# EAGLE design v3 (EAGLE 6.3)

## Sheet 1 of 3
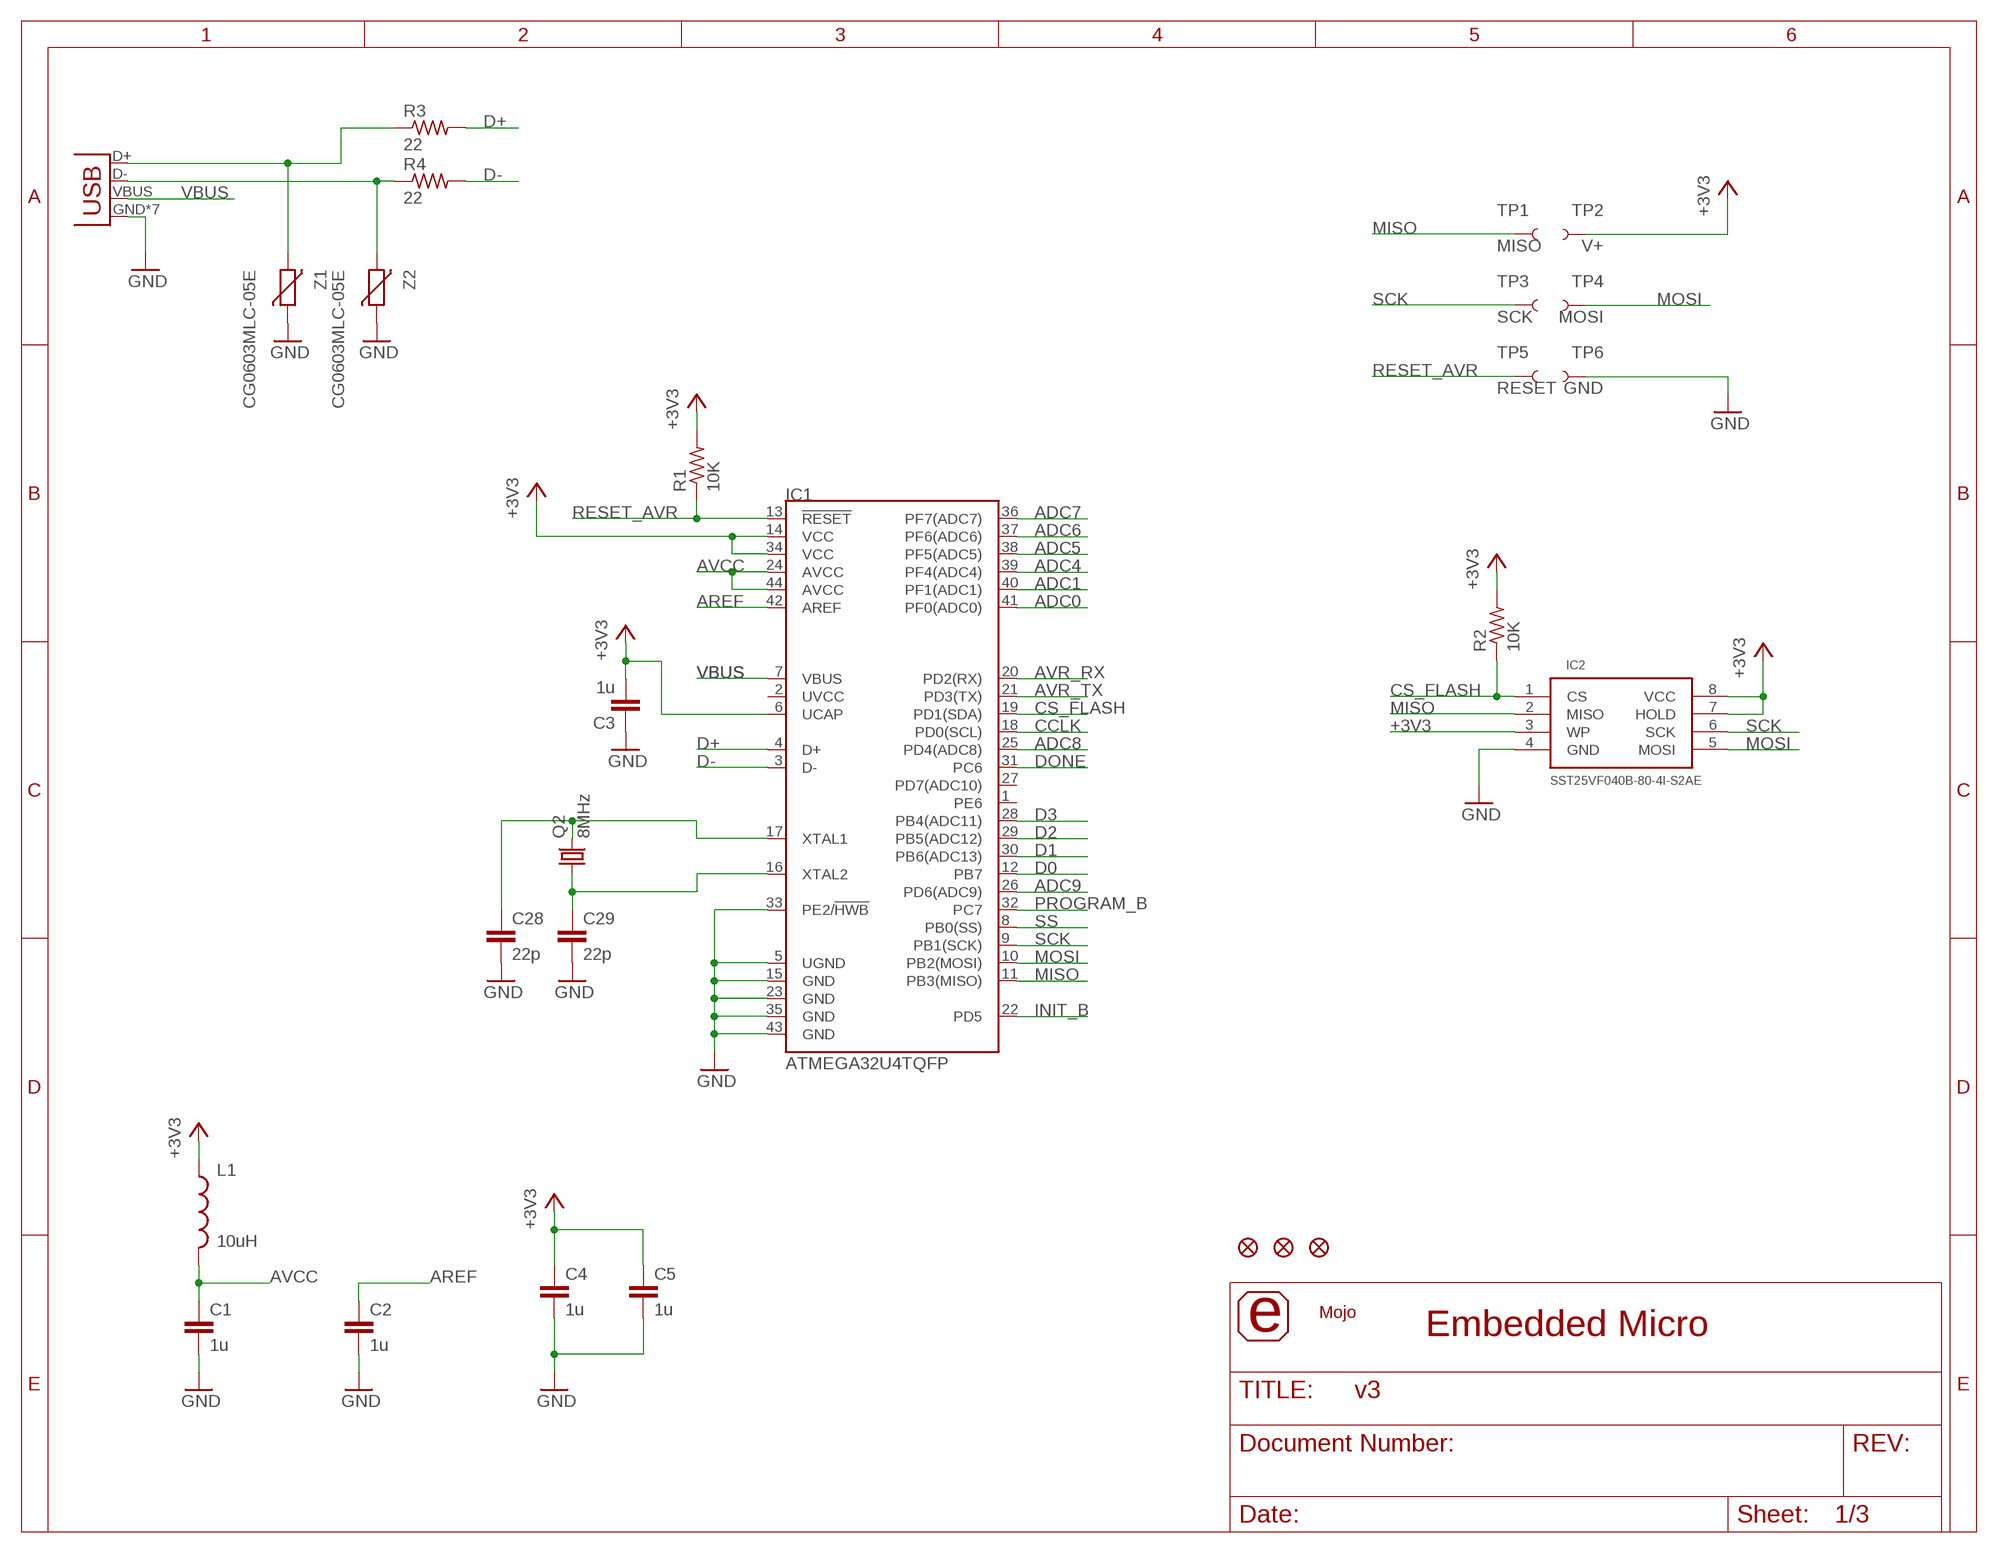
[diagram p0: schematic, sheet 1]

### Parts
C1  1u  C-EUC0603K  [C0603K]
C2  1u  C-EUC0603K  [C0603K]
C3  1u  C-EUC0603K  [C0603K]
C4  1u  C-EUC0603K  [C0603K]
C5  1u  C-EUC0603K  [C0603K]
C28  22p  C-EUC0603K  [C0603K]
C29  22p  C-EUC0603K  [C0603K]
IC1  ATMEGA32U4TQFP  [SPARKFUN-DIGITALIC_TQFP44]
IC2  SST25VF040B-80-4I-S2AE  SPI_FLASH-X25XXSMD1  [SO08-EIAJ]
JP3  FIDUCIAL1X2  [FIDUCIAL-1X2]
JP4  FIDUCIAL1X2  [FIDUCIAL-1X2]
JP5  FIDUCIAL1X2  [FIDUCIAL-1X2]
L1  10uH  INDUCTOR0603  [0603]
Q2  8MHz  CRYSTALABM2  [ABM2]
R1  10K  R-US_R0603  [R0603]
R2  10K  R-US_R0603  [R0603]
R3  22  R-US_R0603  [R0603]
R4  22  R-US_R0603  [R0603]
TP1  MISO  TEST-POINT3X5  [PAD.03X.05]
TP2  V+  TEST-POINT3X5  [PAD.03X.05]
TP3  SCK  TEST-POINT3X5  [PAD.03X.05]
TP4  MOSI  TEST-POINT3X5  [PAD.03X.05]
TP5  RESET  TEST-POINT3X5  [PAD.03X.05]
TP6  GND  TEST-POINT3X5  [PAD.03X.05]
U$1  LOGO(SMALL)SMALL  [LOGO]
U$2  MOJO_LOGOV3  [MOJO_LOGO_V3]
X1  USB-MICROB  [USB-MICROB]
Z1  CG0603MLC-05E  VARISTORCN0603  [CT/CN0603]
Z2  CG0603MLC-05E  VARISTORCN0603  [CT/CN0603]

### Nets
+3V3: C3.2 C4.1 C5.1 IC1.6(UCAP) IC1.14(VCC) IC1.34(VCC) IC2.3(WP) IC2.7(HOLD) IC2.8(VCC) L1.1 R1.2 R2.2 TP2.P$1 ; also sheet 2,3
ADC0: IC1.41(PF0(ADC0)) ; also sheet 3
ADC1: IC1.40(PF1(ADC1)) ; also sheet 3
ADC4: IC1.39(PF4(ADC4)) ; also sheet 3
ADC5: IC1.38(PF5(ADC5)) ; also sheet 3
ADC6: IC1.37(PF6(ADC6)) ; also sheet 3
ADC7: IC1.36(PF7(ADC7)) ; also sheet 3
ADC8: IC1.25(PD4(ADC8)) ; also sheet 3
ADC9: IC1.26(PD6(ADC9)) ; also sheet 3
AREF: C2.1 IC1.42(AREF) ; also sheet 3
AVCC: C1.1 IC1.24(AVCC) IC1.44(AVCC) L1.2
AVR_RX: IC1.20(PD2(RX)) ; also sheet 2
AVR_TX: IC1.21(PD3(TX)) ; also sheet 2
CCLK: IC1.18(PD0(SCL)) ; also sheet 2
CS_FLASH: IC1.19(PD1(SDA)) IC2.1(CS) R2.1
D0: IC1.12(PB7) ; also sheet 2
D1: IC1.30(PB6(ADC13)) ; also sheet 2
D2: IC1.29(PB5(ADC12)) ; also sheet 2
D3: IC1.28(PB4(ADC11)) ; also sheet 2
D+: IC1.4(D+) R3.2
D-: IC1.3(D-) R4.2
DONE: IC1.31(PC6) ; also sheet 2,3
GND: C1.2 C2.2 C3.1 C4.2 C5.2 C28.2 C29.2 IC1.5(UGND) IC1.15(GND) IC1.23(GND) IC1.33(PE2/!HWB) IC1.35(GND) IC1.43(GND) IC2.4(GND) TP6.P$1 X1.GND X1.P1(GND) X1.P2(GND) X1.P3(GND) X1.P4(GND) X1.P5(GND) X1.P6(GND) Z1.1 Z2.1 ; also sheet 2,3
INIT_B: IC1.22(PD5) ; also sheet 2
MISO: IC1.11(PB3(MISO)) IC2.2(MISO) TP1.P$1 ; also sheet 2
MOSI: IC1.10(PB2(MOSI)) IC2.5(MOSI) TP4.P$1 ; also sheet 2
N$11: R3.1 X1.D+ Z1.2
N$12: R4.1 X1.D- Z2.2
N$13: C28.1 IC1.17(XTAL1) Q2.P$2
N$14: C29.1 IC1.16(XTAL2) Q2.P$1
PROGRAM_B: IC1.32(PC7) ; also sheet 2
RESET_AVR: IC1.13(!RESET) R1.1 TP5.P$1
SCK: IC1.9(PB1(SCK)) IC2.6(SCK) TP3.P$1 ; also sheet 2
SS: IC1.8(PB0(SS)) ; also sheet 2
VBUS: IC1.7(VBUS) X1.VBUS ; also sheet 3
Unconnected: IC1.1(PE6) IC1.2(UVCC) IC1.27(PD7(ADC10))

### Notes on the sheet
- Embedded Micro

## Sheet 2 of 3
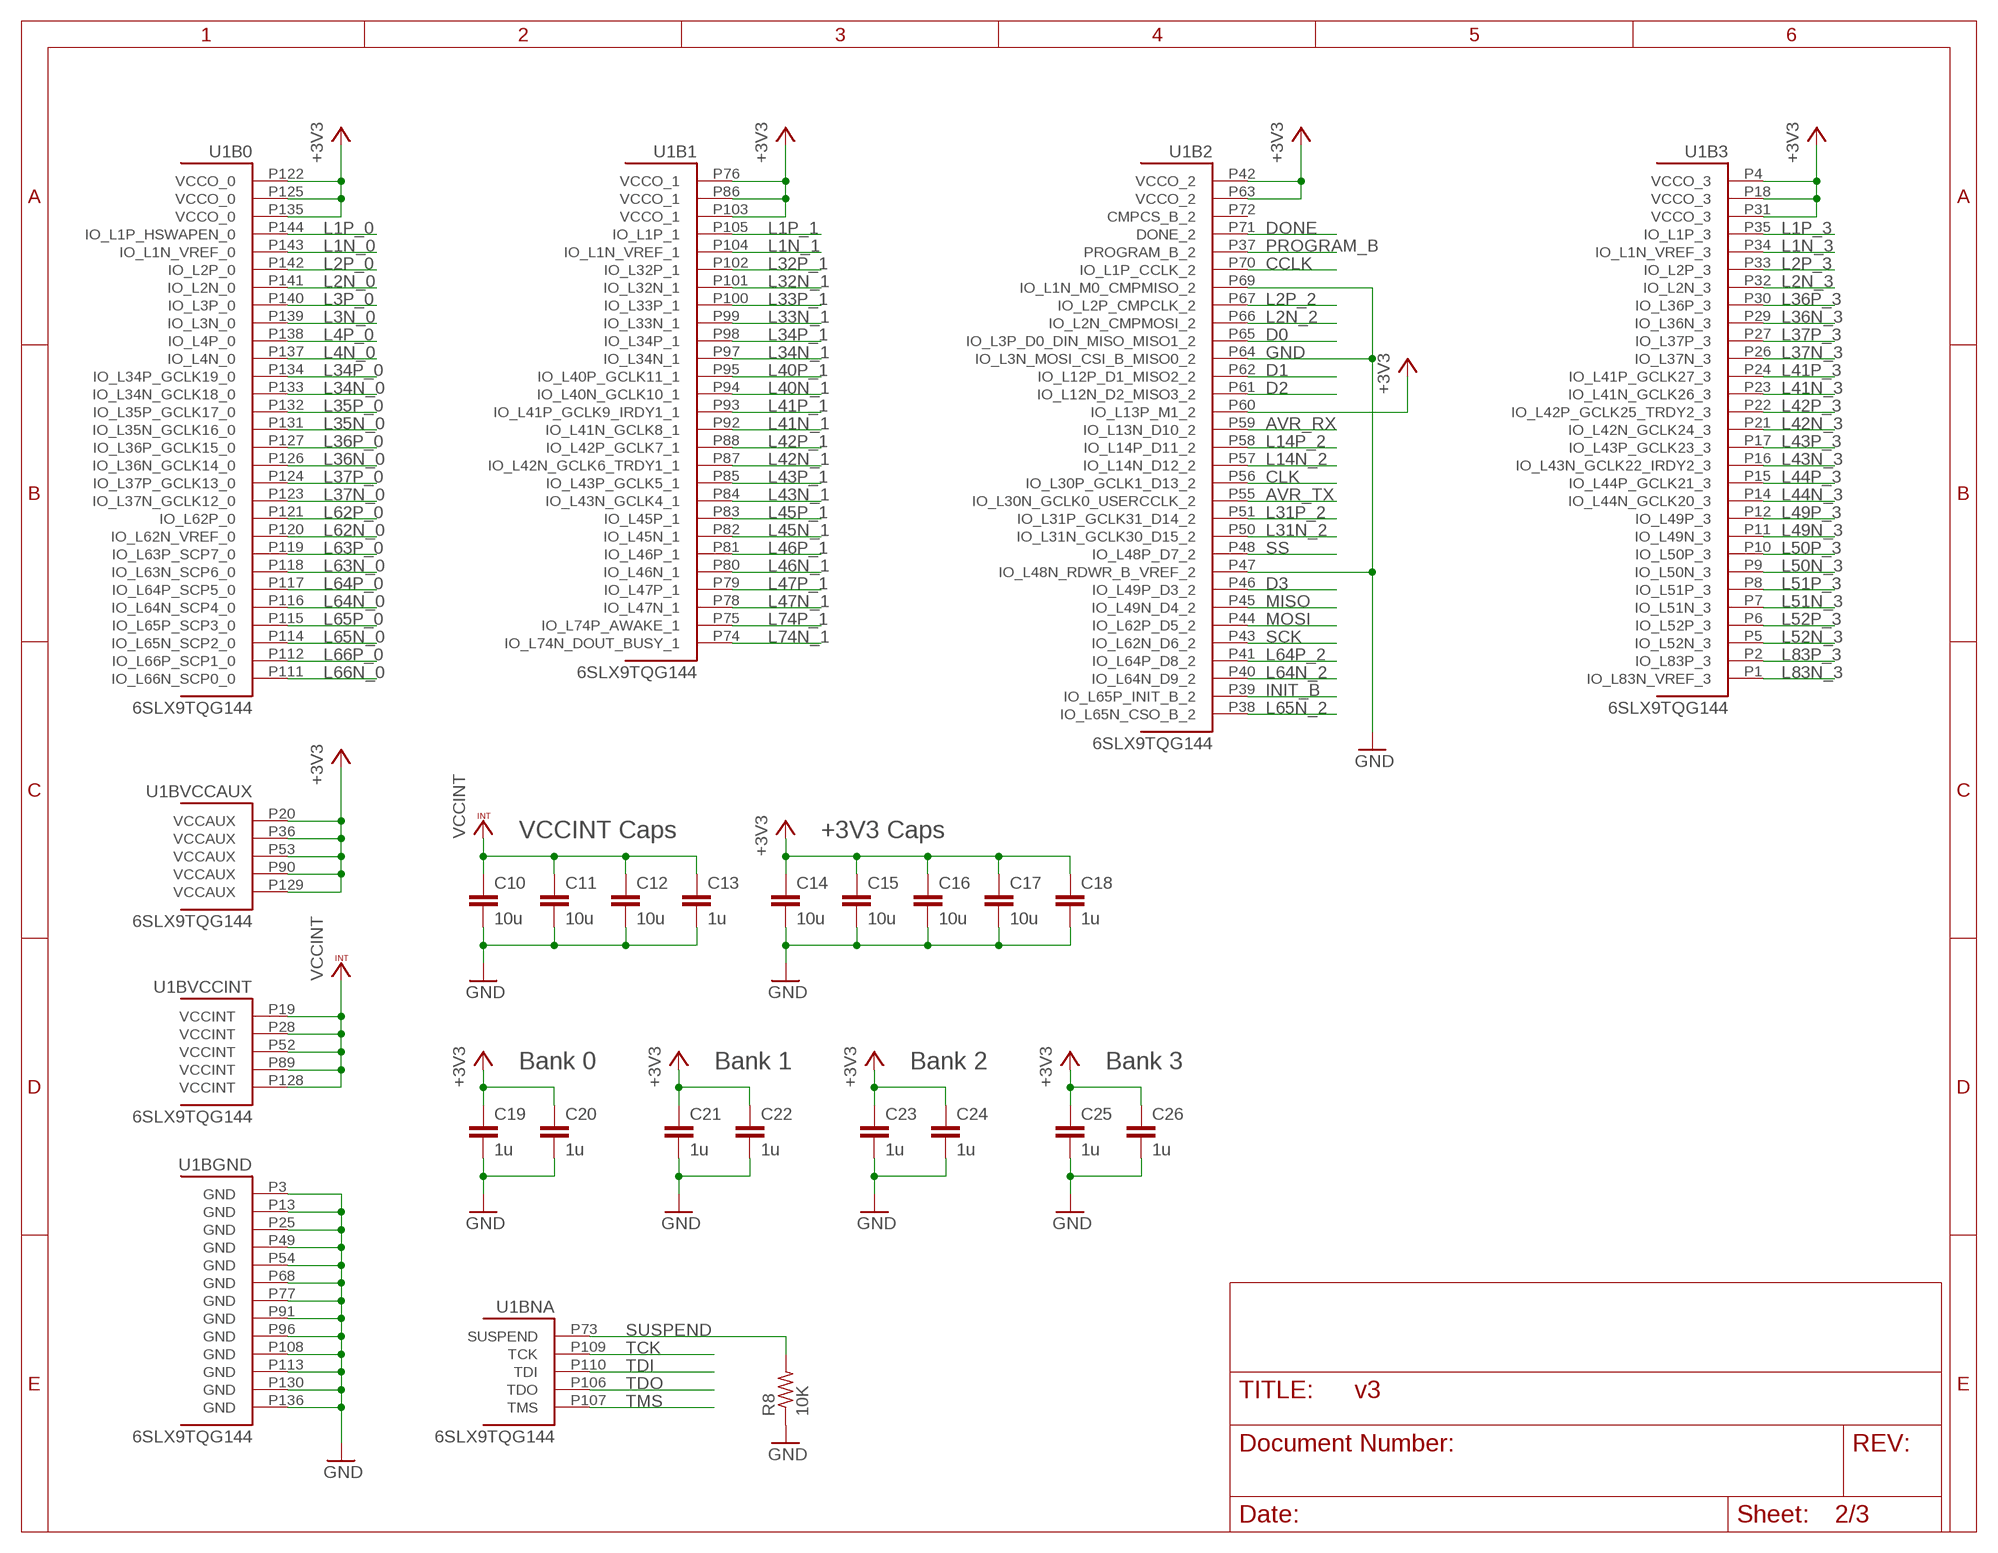
[diagram p1: schematic, sheet 2]

### Parts
C10  10u  C-EUC0603K  [C0603K]
C11  10u  C-EUC0603K  [C0603K]
C12  10u  C-EUC0603K  [C0603K]
C13  1u  C-EUC0603K  [C0603K]
C14  10u  C-EUC0603K  [C0603K]
C15  10u  C-EUC0603K  [C0603K]
C16  10u  C-EUC0603K  [C0603K]
C17  10u  C-EUC0603K  [C0603K]
C18  1u  C-EUC0603K  [C0603K]
C19  1u  C-EUC0603K  [C0603K]
C20  1u  C-EUC0603K  [C0603K]
C21  1u  C-EUC0603K  [C0603K]
C22  1u  C-EUC0603K  [C0603K]
C23  1u  C-EUC0603K  [C0603K]
C24  1u  C-EUC0603K  [C0603K]
C25  1u  C-EUC0603K  [C0603K]
C26  1u  C-EUC0603K  [C0603K]
R8  10K  R-US_R0603  [R0603]
U1  6SLX9TQG144  [TQ144]

### Nets
+3V3: C14.1 C15.1 C16.1 C17.1 C18.1 C19.1 C20.1 C21.1 C22.1 C23.1 C24.1 C25.1 C26.1 U1.P4(B3:VCCO_3) U1.P18(B3:VCCO_3) U1.P20(BVCCAUX:VCCAUX) U1.P31(B3:VCCO_3) U1.P36(BVCCAUX:VCCAUX) U1.P42(B2:VCCO_2) U1.P53(BVCCAUX:VCCAUX) U1.P60(B2:IO_L13P_M1_2) U1.P63(B2:VCCO_2) U1.P76(B1:VCCO_1) U1.P86(B1:VCCO_1) U1.P90(BVCCAUX:VCCAUX) U1.P103(B1:VCCO_1) U1.P122(B0:VCCO_0) U1.P125(B0:VCCO_0) U1.P129(BVCCAUX:VCCAUX) U1.P135(B0:VCCO_0) ; also sheet 1,3
AVR_RX: U1.P59(B2:IO_L13N_D10_2) ; also sheet 1
AVR_TX: U1.P55(B2:IO_L30N_GCLK0_USERCCLK_2) ; also sheet 1
CCLK: U1.P70(B2:IO_L1P_CCLK_2) ; also sheet 1
CLK: U1.P56(B2:IO_L30P_GCLK1_D13_2) ; also sheet 3
D0: U1.P65(B2:IO_L3P_D0_DIN_MISO_MISO1_2) ; also sheet 1
D1: U1.P62(B2:IO_L12P_D1_MISO2_2) ; also sheet 1
D2: U1.P61(B2:IO_L12N_D2_MISO3_2) ; also sheet 1
D3: U1.P46(B2:IO_L49P_D3_2) ; also sheet 1
DONE: U1.P71(B2:DONE_2) ; also sheet 1,3
GND: C10.2 C11.2 C12.2 C13.2 C14.2 C15.2 C16.2 C17.2 C18.2 C19.2 C20.2 C21.2 C22.2 C23.2 C24.2 C25.2 C26.2 R8.1 U1.P3(BGND:GND) U1.P13(BGND:GND) U1.P25(BGND:GND) U1.P47(B2:IO_L48N_RDWR_B_VREF_2) U1.P49(BGND:GND) U1.P54(BGND:GND) U1.P64(B2:IO_L3N_MOSI_CSI_B_MISO0_2) U1.P68(BGND:GND) U1.P69(B2:IO_L1N_M0_CMPMISO_2) U1.P77(BGND:GND) U1.P91(BGND:GND) U1.P96(BGND:GND) U1.P108(BGND:GND) U1.P113(BGND:GND) U1.P130(BGND:GND) U1.P136(BGND:GND) ; also sheet 1,3
INIT_B: U1.P39(B2:IO_L65P_INIT_B_2) ; also sheet 1
L1N_0: U1.P143(B0:IO_L1N_VREF_0) ; also sheet 3
L1N_1: U1.P104(B1:IO_L1N_VREF_1) ; also sheet 3
L1N_3: U1.P34(B3:IO_L1N_VREF_3) ; also sheet 3
L1P_0: U1.P144(B0:IO_L1P_HSWAPEN_0) ; also sheet 3
L1P_1: U1.P105(B1:IO_L1P_1) ; also sheet 3
L1P_3: U1.P35(B3:IO_L1P_3) ; also sheet 3
L2N_0: U1.P141(B0:IO_L2N_0) ; also sheet 3
L2N_2: U1.P66(B2:IO_L2N_CMPMOSI_2) ; also sheet 3
L2N_3: U1.P32(B3:IO_L2N_3) ; also sheet 3
L2P_0: U1.P142(B0:IO_L2P_0) ; also sheet 3
L2P_2: U1.P67(B2:IO_L2P_CMPCLK_2) ; also sheet 3
L2P_3: U1.P33(B3:IO_L2P_3) ; also sheet 3
L3N_0: U1.P139(B0:IO_L3N_0) ; also sheet 3
L3P_0: U1.P140(B0:IO_L3P_0) ; also sheet 3
L4N_0: U1.P137(B0:IO_L4N_0) ; also sheet 3
L4P_0: U1.P138(B0:IO_L4P_0) ; also sheet 3
L14N_2: U1.P57(B2:IO_L14N_D12_2) ; also sheet 3
L14P_2: U1.P58(B2:IO_L14P_D11_2) ; also sheet 3
L31N_2: U1.P50(B2:IO_L31N_GCLK30_D15_2) ; also sheet 3
L31P_2: U1.P51(B2:IO_L31P_GCLK31_D14_2) ; also sheet 3
L32N_1: U1.P101(B1:IO_L32N_1) ; also sheet 3
L32P_1: U1.P102(B1:IO_L32P_1) ; also sheet 3
L33N_1: U1.P99(B1:IO_L33N_1) ; also sheet 3
L33P_1: U1.P100(B1:IO_L33P_1) ; also sheet 3
L34N_0: U1.P133(B0:IO_L34N_GCLK18_0) ; also sheet 3
L34N_1: U1.P97(B1:IO_L34N_1) ; also sheet 3
L34P_0: U1.P134(B0:IO_L34P_GCLK19_0) ; also sheet 3
L34P_1: U1.P98(B1:IO_L34P_1) ; also sheet 3
L35N_0: U1.P131(B0:IO_L35N_GCLK16_0) ; also sheet 3
L35P_0: U1.P132(B0:IO_L35P_GCLK17_0) ; also sheet 3
L36N_0: U1.P126(B0:IO_L36N_GCLK14_0) ; also sheet 3
L36N_3: U1.P29(B3:IO_L36N_3) ; also sheet 3
L36P_0: U1.P127(B0:IO_L36P_GCLK15_0) ; also sheet 3
L36P_3: U1.P30(B3:IO_L36P_3) ; also sheet 3
L37N_0: U1.P123(B0:IO_L37N_GCLK12_0) ; also sheet 3
L37N_3: U1.P26(B3:IO_L37N_3) ; also sheet 3
L37P_0: U1.P124(B0:IO_L37P_GCLK13_0) ; also sheet 3
L37P_3: U1.P27(B3:IO_L37P_3) ; also sheet 3
L40N_1: U1.P94(B1:IO_L40N_GCLK10_1) ; also sheet 3
L40P_1: U1.P95(B1:IO_L40P_GCLK11_1) ; also sheet 3
L41N_1: U1.P92(B1:IO_L41N_GCLK8_1) ; also sheet 3
L41N_3: U1.P23(B3:IO_L41N_GCLK26_3) ; also sheet 3
L41P_1: U1.P93(B1:IO_L41P_GCLK9_IRDY1_1) ; also sheet 3
L41P_3: U1.P24(B3:IO_L41P_GCLK27_3) ; also sheet 3
L42N_1: U1.P87(B1:IO_L42N_GCLK6_TRDY1_1) ; also sheet 3
L42N_3: U1.P21(B3:IO_L42N_GCLK24_3) ; also sheet 3
L42P_1: U1.P88(B1:IO_L42P_GCLK7_1) ; also sheet 3
L42P_3: U1.P22(B3:IO_L42P_GCLK25_TRDY2_3) ; also sheet 3
L43N_1: U1.P84(B1:IO_L43N_GCLK4_1) ; also sheet 3
L43N_3: U1.P16(B3:IO_L43N_GCLK22_IRDY2_3) ; also sheet 3
L43P_1: U1.P85(B1:IO_L43P_GCLK5_1) ; also sheet 3
L43P_3: U1.P17(B3:IO_L43P_GCLK23_3) ; also sheet 3
L44N_3: U1.P14(B3:IO_L44N_GCLK20_3) ; also sheet 3
L44P_3: U1.P15(B3:IO_L44P_GCLK21_3) ; also sheet 3
L45N_1: U1.P82(B1:IO_L45N_1) ; also sheet 3
L45P_1: U1.P83(B1:IO_L45P_1) ; also sheet 3
L46N_1: U1.P80(B1:IO_L46N_1) ; also sheet 3
L46P_1: U1.P81(B1:IO_L46P_1) ; also sheet 3
L47N_1: U1.P78(B1:IO_L47N_1) ; also sheet 3
L47P_1: U1.P79(B1:IO_L47P_1) ; also sheet 3
L49N_3: U1.P11(B3:IO_L49N_3) ; also sheet 3
L49P_3: U1.P12(B3:IO_L49P_3) ; also sheet 3
L50N_3: U1.P9(B3:IO_L50N_3) ; also sheet 3
L50P_3: U1.P10(B3:IO_L50P_3) ; also sheet 3
L51N_3: U1.P7(B3:IO_L51N_3) ; also sheet 3
L51P_3: U1.P8(B3:IO_L51P_3) ; also sheet 3
L52N_3: U1.P5(B3:IO_L52N_3) ; also sheet 3
L52P_3: U1.P6(B3:IO_L52P_3) ; also sheet 3
L62N_0: U1.P120(B0:IO_L62N_VREF_0) ; also sheet 3
L62P_0: U1.P121(B0:IO_L62P_0) ; also sheet 3
L63N_0: U1.P118(B0:IO_L63N_SCP6_0) ; also sheet 3
L63P_0: U1.P119(B0:IO_L63P_SCP7_0) ; also sheet 3
L64N_0: U1.P116(B0:IO_L64N_SCP4_0) ; also sheet 3
L64N_2: U1.P40(B2:IO_L64N_D9_2) ; also sheet 3
L64P_0: U1.P117(B0:IO_L64P_SCP5_0) ; also sheet 3
L64P_2: U1.P41(B2:IO_L64P_D8_2) ; also sheet 3
L65N_0: U1.P114(B0:IO_L65N_SCP2_0) ; also sheet 3
L65N_2: U1.P38(B2:IO_L65N_CSO_B_2) ; also sheet 3
L65P_0: U1.P115(B0:IO_L65P_SCP3_0) ; also sheet 3
L66N_0: U1.P111(B0:IO_L66N_SCP0_0) ; also sheet 3
L66P_0: U1.P112(B0:IO_L66P_SCP1_0) ; also sheet 3
L74N_1: U1.P74(B1:IO_L74N_DOUT_BUSY_1) ; also sheet 3
L74P_1: U1.P75(B1:IO_L74P_AWAKE_1) ; also sheet 3
L83N_3: U1.P1(B3:IO_L83N_VREF_3) ; also sheet 3
L83P_3: U1.P2(B3:IO_L83P_3) ; also sheet 3
MISO: U1.P45(B2:IO_L49N_D4_2) ; also sheet 1
MOSI: U1.P44(B2:IO_L62P_D5_2) ; also sheet 1
PROGRAM_B: U1.P37(B2:PROGRAM_B_2) ; also sheet 1
SCK: U1.P43(B2:IO_L62N_D6_2) ; also sheet 1
SS: U1.P48(B2:IO_L48P_D7_2) ; also sheet 1
SUSPEND: R8.2 U1.P73(BNA:SUSPEND) ; also sheet 3
TCK: U1.P109(BNA:TCK) ; also sheet 3
TDI: U1.P110(BNA:TDI) ; also sheet 3
TDO: U1.P106(BNA:TDO) ; also sheet 3
TMS: U1.P107(BNA:TMS) ; also sheet 3
VCCINT: C10.1 C11.1 C12.1 C13.1 U1.P19(BVCCINT:VCCINT) U1.P28(BVCCINT:VCCINT) U1.P52(BVCCINT:VCCINT) U1.P89(BVCCINT:VCCINT) U1.P128(BVCCINT:VCCINT) ; also sheet 3
Unconnected: U1.P72(B2:CMPCS_B_2)

### Notes on the sheet
- VCCINT Caps | +3V3 Caps
- Bank 0 | Bank 1 | Bank 2 | Bank 3

## Sheet 3 of 3
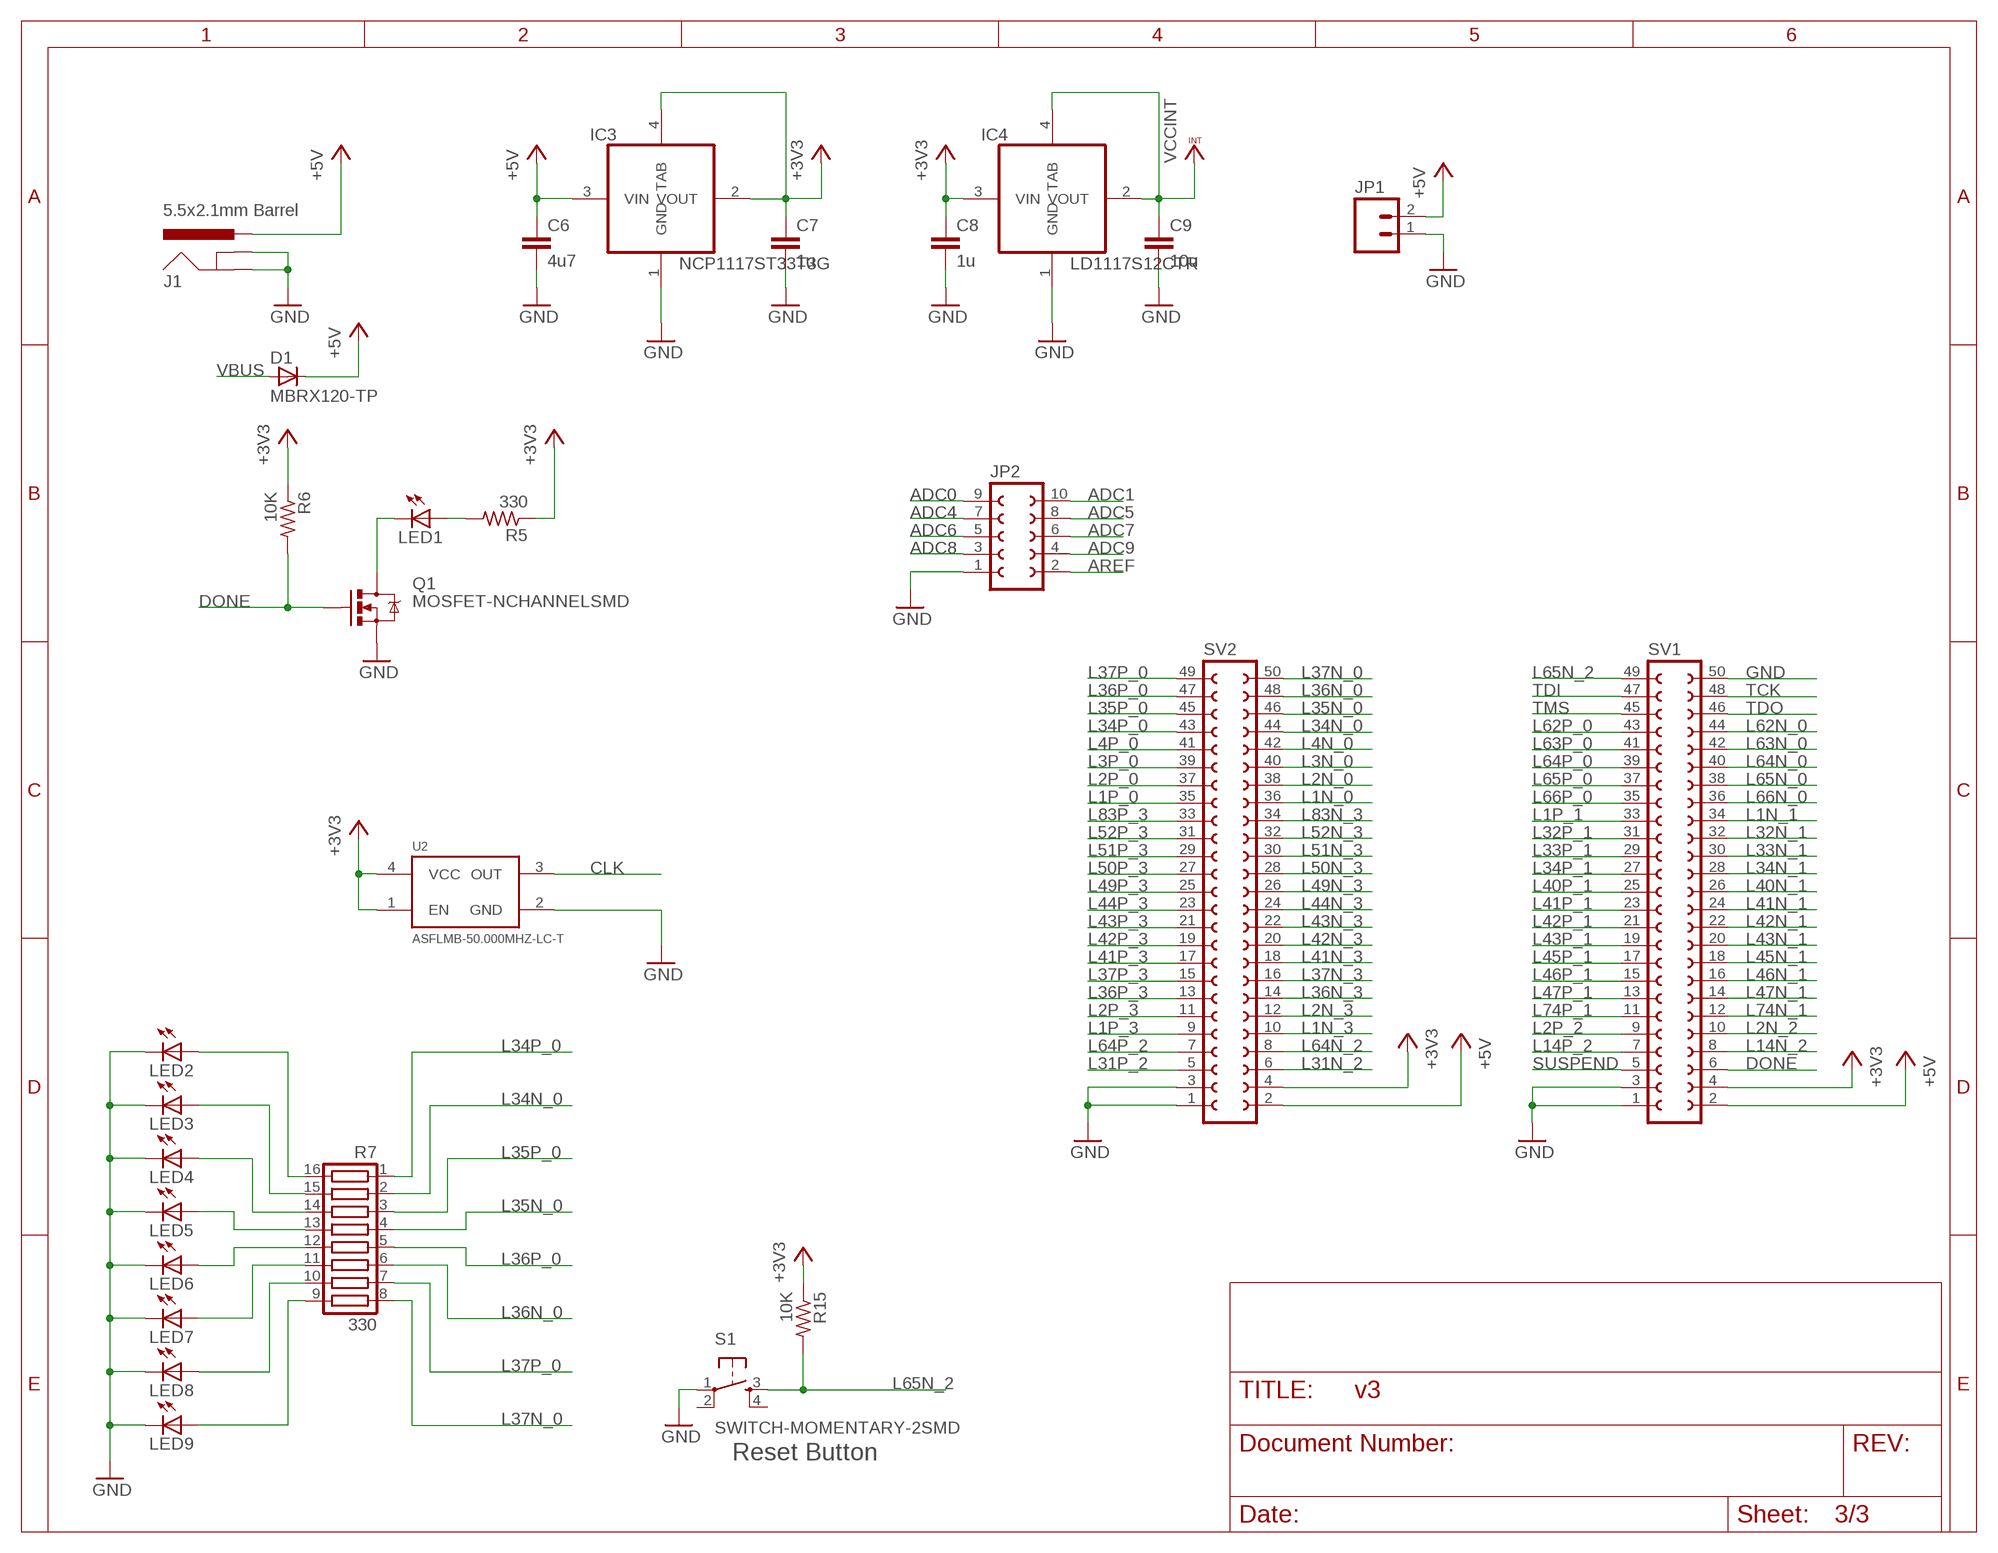
[diagram p2: schematic, sheet 3]

### Parts
C6  4u7  C-EUC1206  [C1206]
C7  1u  C-EUC0603K  [C0603K]
C8  1u  C-EUC0603K  [C0603K]
C9  10u  C-EUC0603K  [C0603K]
D1  MBRX120-TP  D-SOD123  [SOD123]
IC3  NCP1117ST33T3G  REG1117  [SOT223]
IC4  LD1117S12CTR  REG1117  [SOT223]
J1  5.5x2.1mm Barrel  POWER_JACKSMD  [POWER_JACK_SMD]
JP1  M02PTH  [1X02]
JP2  FE05-2  [FE05-2]
LED1  LED1206  [LED-1206]
LED2  LED1206  [LED-1206]
LED3  LED1206  [LED-1206]
LED4  LED1206  [LED-1206]
LED5  LED1206  [LED-1206]
LED6  LED1206  [LED-1206]
LED7  LED1206  [LED-1206]
LED8  LED1206  [LED-1206]
LED9  LED1206  [LED-1206]
Q1  MOSFET-NCHANNELSMD  [SOT23-3]
R5  330  R-US_R0603  [R0603]
R6  10K  R-US_R0603  [R0603]
R7  330  CTS742C163  [CTS743C163]
R15  10K  R-US_R0603  [R0603]
S1  SWITCH-MOMENTARY-2SMD  TAC_SWITCHSMD  [TACTILE_SWITCH_SMD]
SV1  FE25-2  [FE25-2]
SV2  FE25-2  [FE25-2]
U2  ASFLMB-50.000MHZ-LC-T  OSCILLATOR5X3-PIN1-INDICATED  [CRYSTAL-OSC-SMD-5X3]

### Nets
+3V3: C7.1 C8.1 IC3.2(VOUT) IC3.4(TAB) IC4.3(VIN) R5.1 R6.1 R15.1 SV1.4 SV2.4 U2.1(EN) U2.4(VCC) ; also sheet 1,2
+5V: C6.1 D1.1(C) IC3.3(VIN) J1.VIN0(PWR) JP1.2 SV1.2 SV2.2
ADC0: JP2.9 ; also sheet 1
ADC1: JP2.10 ; also sheet 1
ADC4: JP2.7 ; also sheet 1
ADC5: JP2.8 ; also sheet 1
ADC6: JP2.5 ; also sheet 1
ADC7: JP2.6 ; also sheet 1
ADC8: JP2.3 ; also sheet 1
ADC9: JP2.4 ; also sheet 1
AREF: JP2.2 ; also sheet 1
CLK: U2.3(OUT) ; also sheet 2
DONE: Q1.1(G) R6.2 SV1.6 ; also sheet 1,2
GND: C6.2 C7.2 C8.2 C9.2 IC3.1(GND) IC4.1(GND) J1.GND(GNDBREAK) J1.P$4(GND) JP1.1 JP2.1 LED2.C LED3.C LED4.C LED5.C LED6.C LED7.C LED8.C LED9.C Q1.2(S) S1.1 SV1.1 SV1.3 SV1.50 SV2.1 SV2.3 U2.2(GND) ; also sheet 1,2
L1N_0: SV2.36 ; also sheet 2
L1N_1: SV1.34 ; also sheet 2
L1N_3: SV2.10 ; also sheet 2
L1P_0: SV2.35 ; also sheet 2
L1P_1: SV1.33 ; also sheet 2
L1P_3: SV2.9 ; also sheet 2
L2N_0: SV2.38 ; also sheet 2
L2N_2: SV1.10 ; also sheet 2
L2N_3: SV2.12 ; also sheet 2
L2P_0: SV2.37 ; also sheet 2
L2P_2: SV1.9 ; also sheet 2
L2P_3: SV2.11 ; also sheet 2
L3N_0: SV2.40 ; also sheet 2
L3P_0: SV2.39 ; also sheet 2
L4N_0: SV2.42 ; also sheet 2
L4P_0: SV2.41 ; also sheet 2
L14N_2: SV1.8 ; also sheet 2
L14P_2: SV1.7 ; also sheet 2
L31N_2: SV2.6 ; also sheet 2
L31P_2: SV2.5 ; also sheet 2
L32N_1: SV1.32 ; also sheet 2
L32P_1: SV1.31 ; also sheet 2
L33N_1: SV1.30 ; also sheet 2
L33P_1: SV1.29 ; also sheet 2
L34N_0: R7.2 SV2.44 ; also sheet 2
L34N_1: SV1.28 ; also sheet 2
L34P_0: R7.1 SV2.43 ; also sheet 2
L34P_1: SV1.27 ; also sheet 2
L35N_0: R7.4 SV2.46 ; also sheet 2
L35P_0: R7.3 SV2.45 ; also sheet 2
L36N_0: R7.6 SV2.48 ; also sheet 2
L36N_3: SV2.14 ; also sheet 2
L36P_0: R7.5 SV2.47 ; also sheet 2
L36P_3: SV2.13 ; also sheet 2
L37N_0: R7.8 SV2.50 ; also sheet 2
L37N_3: SV2.16 ; also sheet 2
L37P_0: R7.7 SV2.49 ; also sheet 2
L37P_3: SV2.15 ; also sheet 2
L40N_1: SV1.26 ; also sheet 2
L40P_1: SV1.25 ; also sheet 2
L41N_1: SV1.24 ; also sheet 2
L41N_3: SV2.18 ; also sheet 2
L41P_1: SV1.23 ; also sheet 2
L41P_3: SV2.17 ; also sheet 2
L42N_1: SV1.22 ; also sheet 2
L42N_3: SV2.20 ; also sheet 2
L42P_1: SV1.21 ; also sheet 2
L42P_3: SV2.19 ; also sheet 2
L43N_1: SV1.20 ; also sheet 2
L43N_3: SV2.22 ; also sheet 2
L43P_1: SV1.19 ; also sheet 2
L43P_3: SV2.21 ; also sheet 2
L44N_3: SV2.24 ; also sheet 2
L44P_3: SV2.23 ; also sheet 2
L45N_1: SV1.18 ; also sheet 2
L45P_1: SV1.17 ; also sheet 2
L46N_1: SV1.16 ; also sheet 2
L46P_1: SV1.15 ; also sheet 2
L47N_1: SV1.14 ; also sheet 2
L47P_1: SV1.13 ; also sheet 2
L49N_3: SV2.26 ; also sheet 2
L49P_3: SV2.25 ; also sheet 2
L50N_3: SV2.28 ; also sheet 2
L50P_3: SV2.27 ; also sheet 2
L51N_3: SV2.30 ; also sheet 2
L51P_3: SV2.29 ; also sheet 2
L52N_3: SV2.32 ; also sheet 2
L52P_3: SV2.31 ; also sheet 2
L62N_0: SV1.44 ; also sheet 2
L62P_0: SV1.43 ; also sheet 2
L63N_0: SV1.42 ; also sheet 2
L63P_0: SV1.41 ; also sheet 2
L64N_0: SV1.40 ; also sheet 2
L64N_2: SV2.8 ; also sheet 2
L64P_0: SV1.39 ; also sheet 2
L64P_2: SV2.7 ; also sheet 2
L65N_0: SV1.38 ; also sheet 2
L65N_2: R15.2 S1.3 SV1.49 ; also sheet 2
L65P_0: SV1.37 ; also sheet 2
L66N_0: SV1.36 ; also sheet 2
L66P_0: SV1.35 ; also sheet 2
L74N_1: SV1.12 ; also sheet 2
L74P_1: SV1.11 ; also sheet 2
L83N_3: SV2.34 ; also sheet 2
L83P_3: SV2.33 ; also sheet 2
N$1: LED1.A R5.2
N$2: LED1.C Q1.3(D)
N$3: LED2.A R7.16
N$4: LED3.A R7.15
N$5: LED4.A R7.14
N$6: LED5.A R7.13
N$7: LED6.A R7.12
N$8: LED7.A R7.11
N$9: LED8.A R7.10
N$10: LED9.A R7.9
SUSPEND: SV1.5 ; also sheet 2
TCK: SV1.48 ; also sheet 2
TDI: SV1.47 ; also sheet 2
TDO: SV1.46 ; also sheet 2
TMS: SV1.45 ; also sheet 2
VBUS: D1.2(A) ; also sheet 1
VCCINT: C9.1 IC4.2(VOUT) IC4.4(TAB) ; also sheet 2
Unconnected: S1.2 S1.4

### Notes on the sheet
- Reset Button

## Library data of the parts
C1-C26 C28 C29 = rcl:C-EU: CAPACITOR, European symbol
D1 = semicon-smd-ipc:D-: DIODE unfilled
IC1 = SparkFun-DigitalIC:ATMEGA32U4: Atmel 44-pin 8-bit Microcontroller with 32KBytes of ISP Flash and USB Controller
IC2 = SparkFun-DigitalIC:SPI_FLASH-X25XX: 8pin SPI Flash series x25xx. Works with devices like W25X32 and BR25L32
IC3 IC4 = burr-brown:REG1117: 800mA and 1A Low Dropout (LDO) Positive Regulator 1.8V, 2.5V, 2.85V, 3.3V, 5V, and Adj; MPN: REG1117; OC_FARNELL: 1097566; OC_NEWARK: 14P6981
J1 = SparkFun-Connectors:POWER_JACK: Power Jack This is the standard 5.5mm barrel jack for power. The PTH is the most common, proven, reliable, footprint. The Slot footprint only works if the mill layer is transmitted to the PCB fab house so be warned. Spark Fun Electronics SKU : PRT-00119 SMT: CONN-08106 Mating wall wart : TOL-00298 (and others); PROD_ID: CONN-08106
JP1 = SparkFun-Connectors:M02: Header 2 Standard 2-pin 0.1" header. Use with straight break away headers (SKU : PRT-00116), right angle break away headers (PRT-00553), swiss pins (PRT-00743), machine pins (PRT-00117), and female headers (PRT-00115). Molex polarized connector foot print use with SKU : PRT-08233 with associated crimp pins and housings.
JP2 = con-lsta:FE05-2: FEMALE HEADER; OC_FARNELL: unknown; OC_NEWARK: unknown
JP3-JP5 = SparkFun-Aesthetics:FIDUCIAL: Fiducial Alignment Points Various fiducial points for machine vision alignment.
L1 = SparkFun-Passives:INDUCTOR: Inductors Basic Inductor/Choke - 0603 and 1206. Footprints are not proven and vary greatly between part numbers.
LED1-LED9 = SparkFun-LED:LED: LEDs Standard schematic elements and footprints for 5mm, 3mm, 1206, and 0603 sized LEDs. 5mm - Spark Fun Electronics SKU : COM-00529 (and others)
Q1 = SparkFun-DiscreteSemi:MOSFET-NCHANNEL: Generic NMOS footprint
Q2 = crystal:CRYSTAL: CRYSTAL
R1-R6 R8 R15 = resistor:R-US_: RESISTOR, American symbol
R7 = resistor-net:CTS742C163
S1 = embeddedmicro:TAC_SWITCH: Momentary Switch Button commonly used for reset or general input. Spark Fun Electronics SKU : COM-00097
SV1 SV2 = con-lsta:FE25-2: FEMALE HEADER; OC_FARNELL: unknown; OC_NEWARK: unknown
TP1-TP6 = SparkFun-Passives:TEST-POINT: Bare copper test points for troubleshooting or ICT
U1 = xilinx_devices:6SLX9TQG144: Xilinx FPGA: 6SLX9TQG144
U2 = embeddedmicro:OSCILLATOR: Generic 5x3 and 7x5 oscillators
U$1 = embeddedmicro:LOGO(SMALL)
U$2 = embeddedmicro:MOJO_LOGO
X1 = embeddedmicro:USB: USB Connectors USB-B-PTH is fully proven SKU : PRT-00139/CONN-08278 USB-miniB is fully proven SKU : PRT-00587 USB-A-PCB is untested. USB-A-H is throughly reviewed, but untested. Spark Fun Electronics SKU : PRT-00437 USB-B-SMT is throughly reviewed, but untested. Needs silkscreen touching up. USB-A-S has not been used/tested USB-MB-H has not been used/tested USB-MICROB has been used. CONN-09505; PROD_ID: CONN-09505
Z1 Z2 = varistor:VARISTOR: VARISTOR

## Net classes
0 default: width 0.152 mm
1 power: width 0.305 mm

## Board
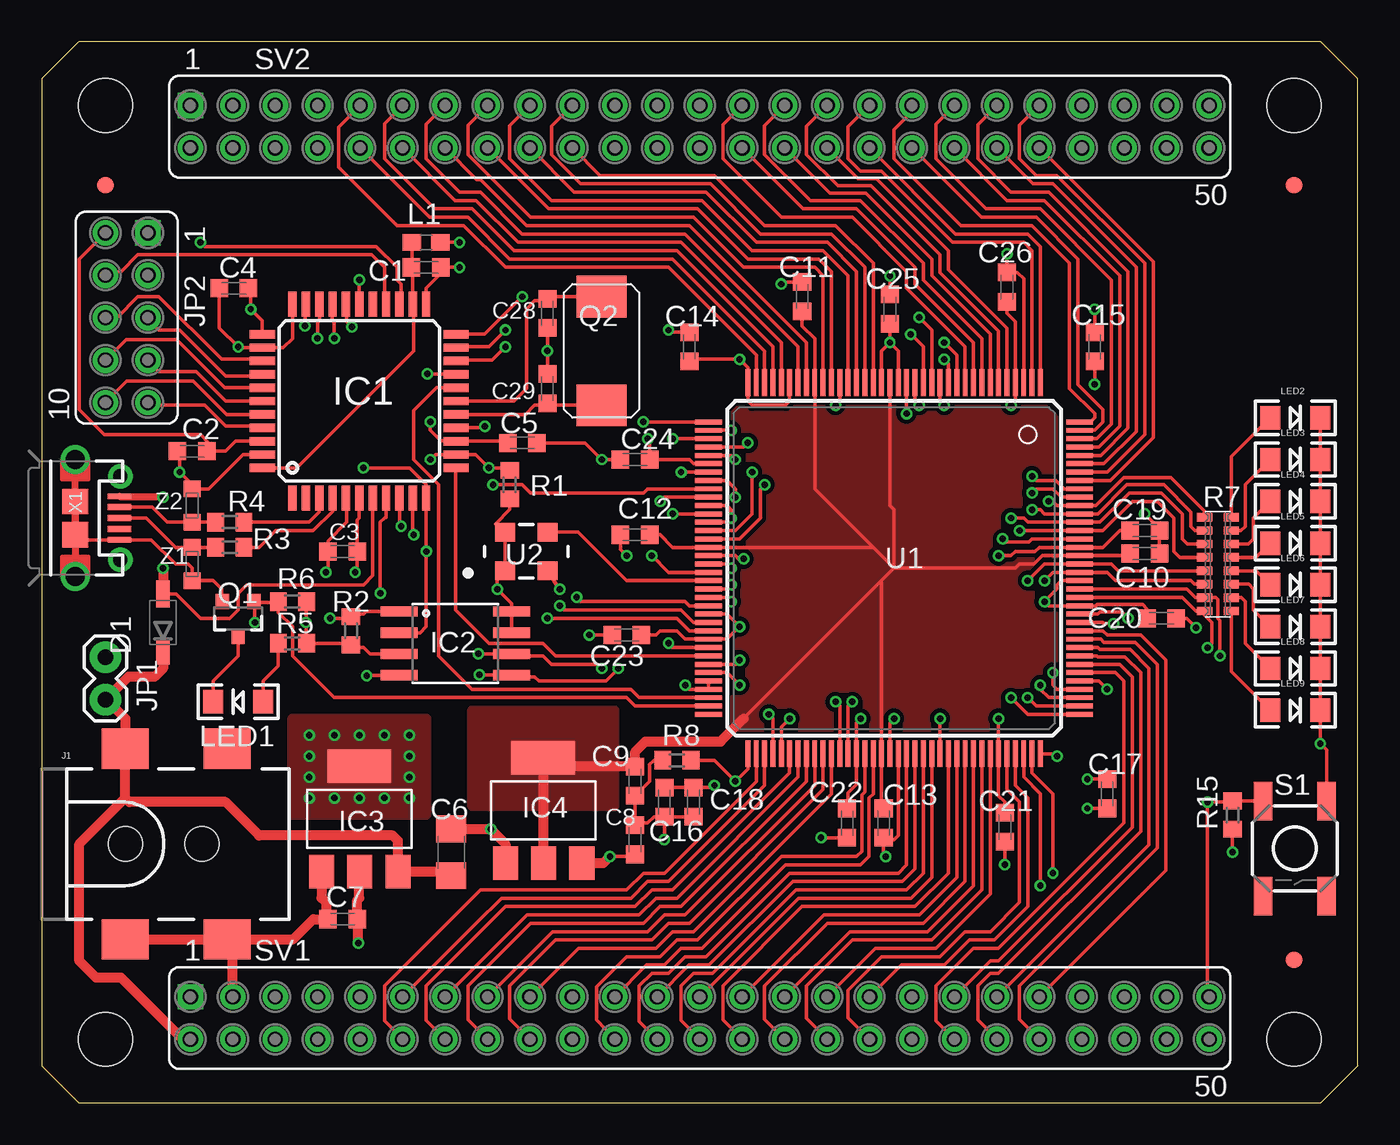
[diagram p3: board, top side]
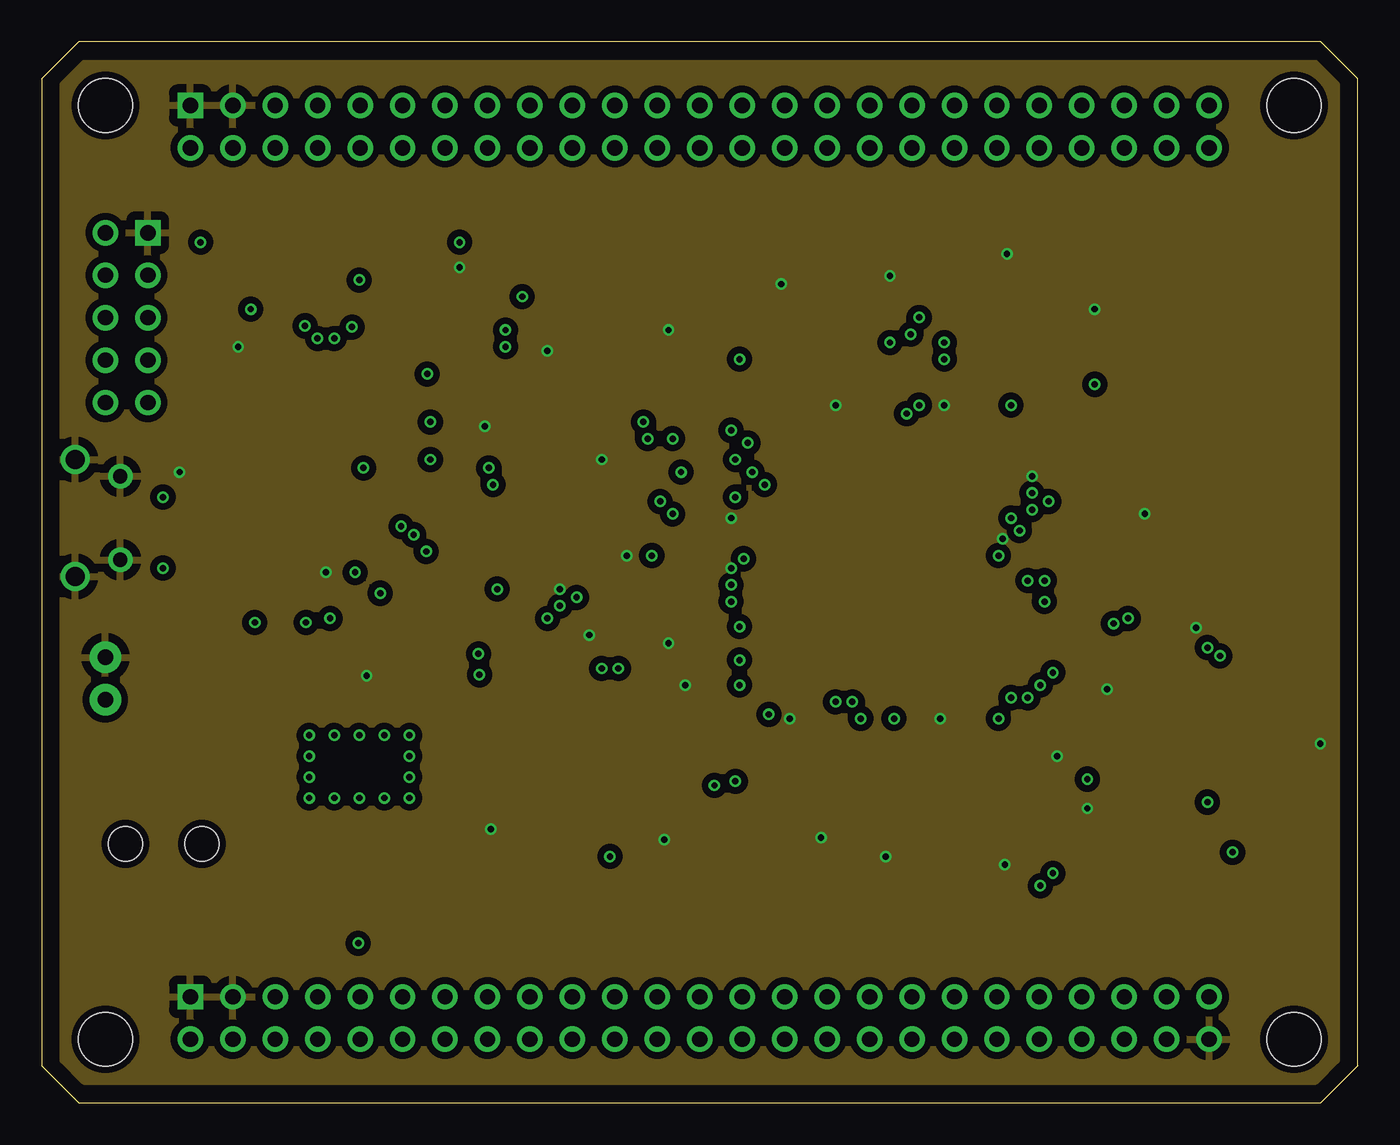
[diagram p4: board, inner layer Ground]
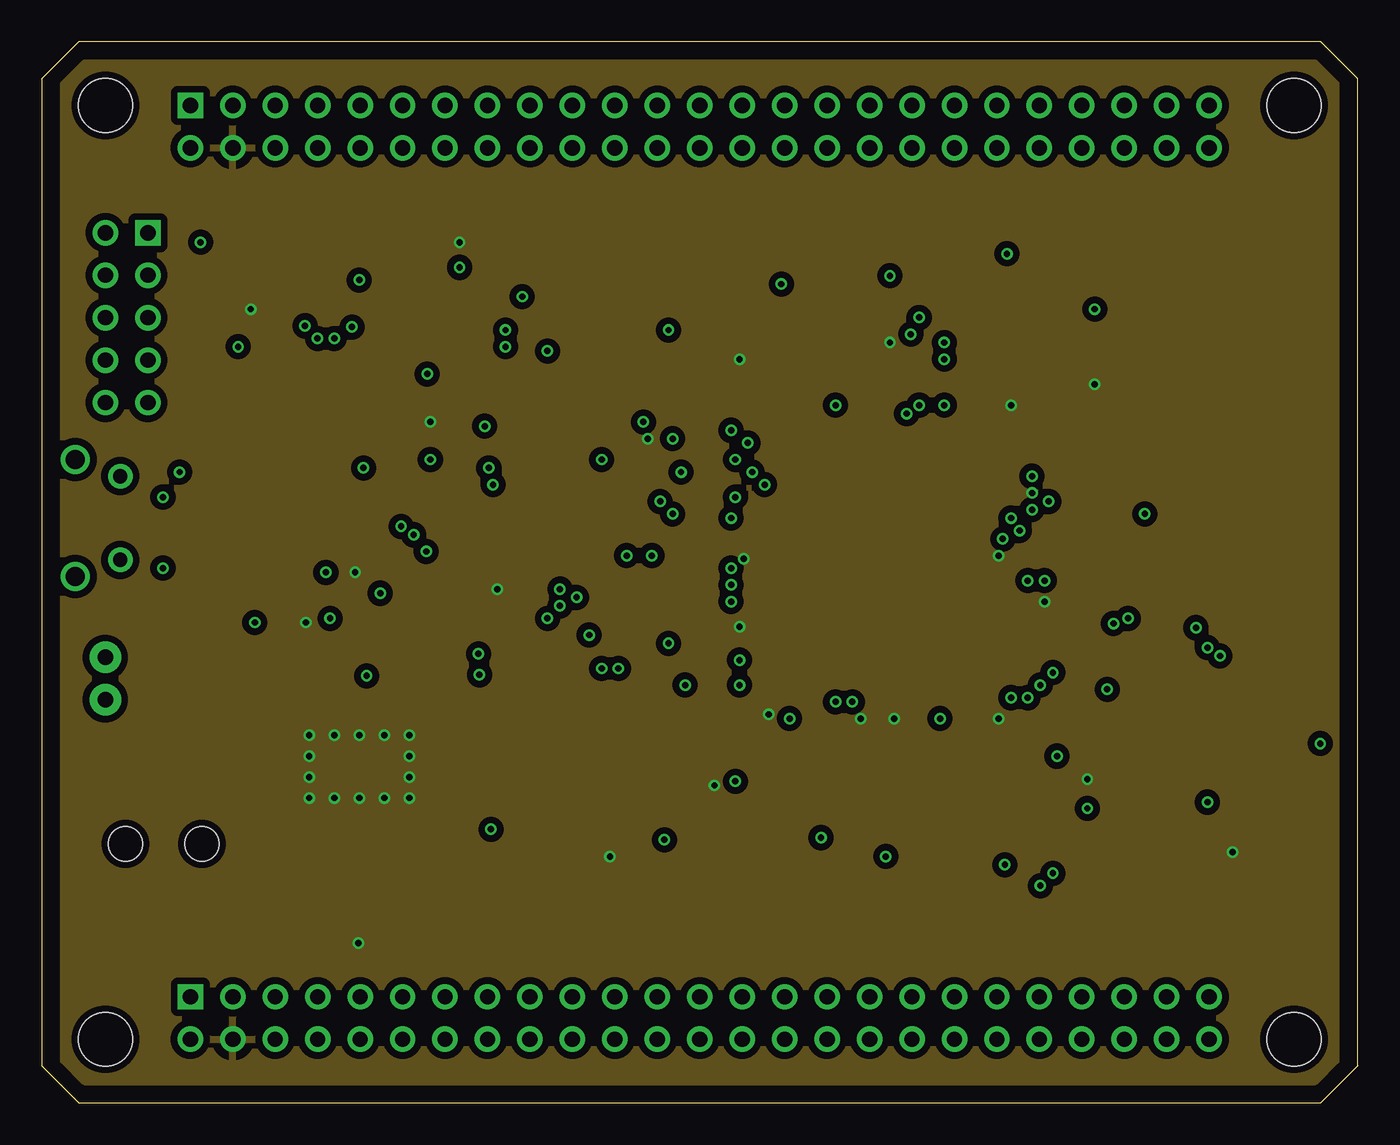
[diagram p5: board, inner layer Power]
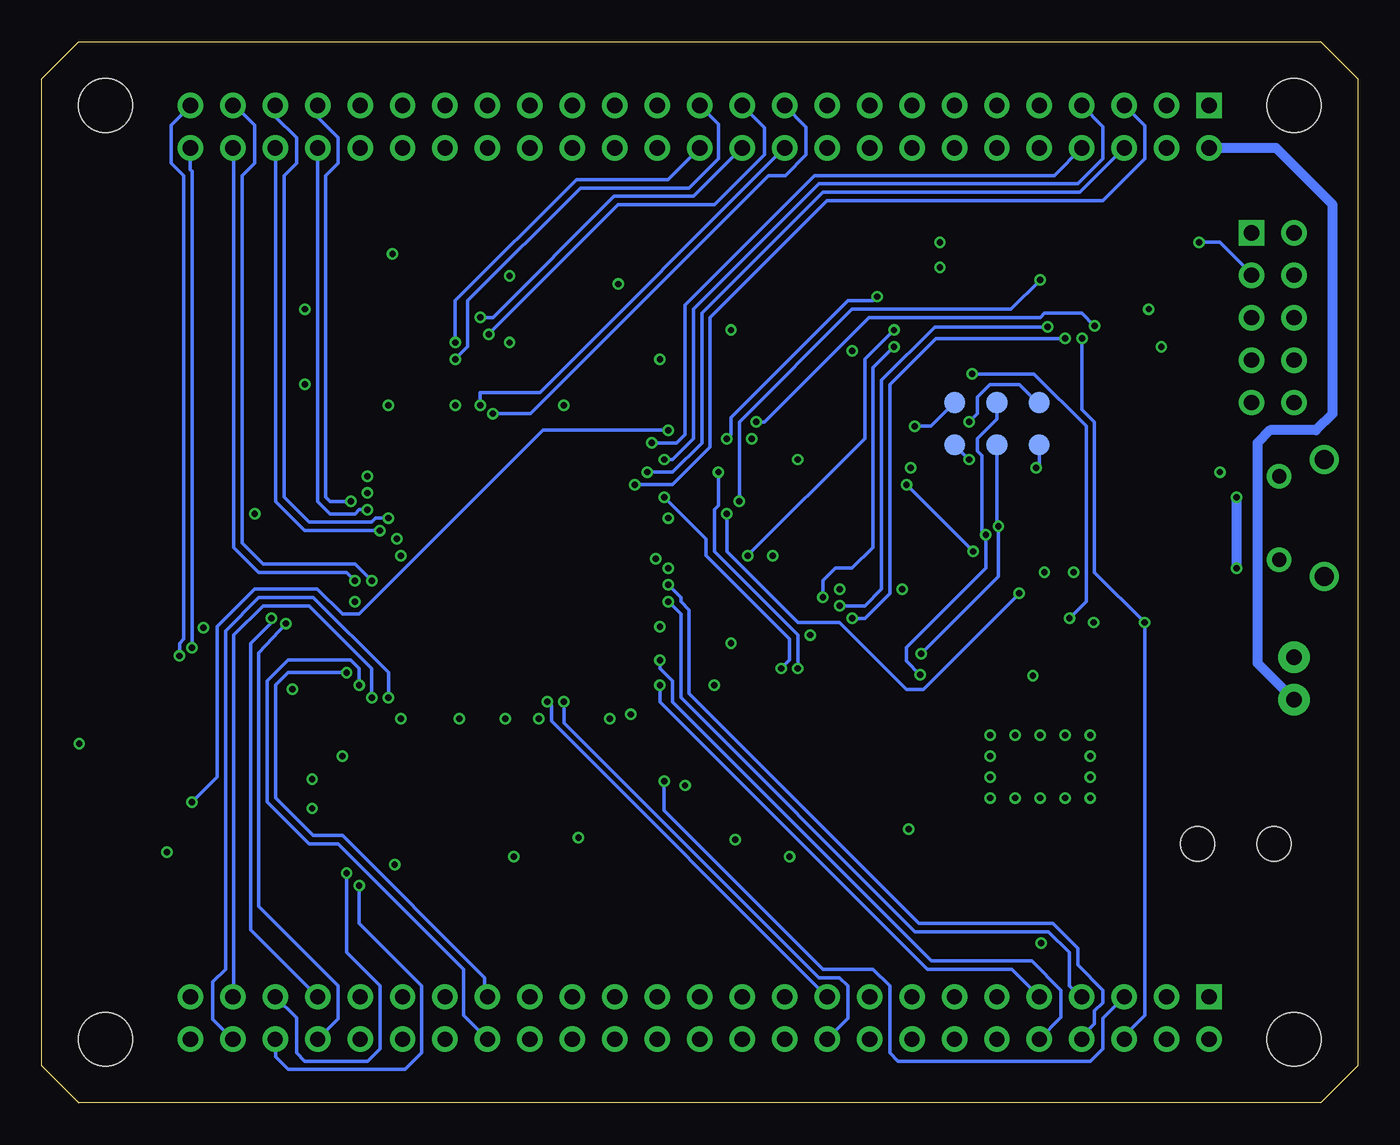
[diagram p6: board, bottom side, seen from below]

Size 78.74 x 63.5 mm. Coordinates in mm from the lower left corner, seen from the top.
Outline: 2.22,0 76.52,0 78.74,2.22 78.74,61.28 76.52,63.5 2.22,63.5 0,61.28 0,2.22 2.22,0
Copper layers (1*2+3*16): Top 0.035mm / dielectric 1.5mm / Ground 0.035mm / dielectric 0.15mm / Power 0.035mm / dielectric 0.2mm / Bottom 0.035mm
Design rules "default *": minimum track width 8mil, minimum drill 15mil, track to track 8mil, track to pad 8mil, pad to pad 8mil, via to via 8mil, smd to smd 8mil, copper to edge 10mil, drill to drill 10mil, minimum pad ring 12mil, minimum via ring 6mil, stop-mask expansion 4mil, vias tented up to drill 15mil, thermal gap 20mil
Holes 3.2 mm at 3.81,3.81 3.81,59.69 74.93,59.69 74.93,3.81

### Footprints (pad centres in the part's own frame; a part is rotated, then mirrored left to right if it is on the bottom)
C0603K = smd 1.05 x 1.08: 1 -0.875,0; 2 0.875,0
C1206 = smd 1.6 x 1.8: 1 -1.4,0; 2 1.4,0
SOD123 = smd 1.6 x 0.8: 1 -1.7,0; 2 1.7,0
SPARKFUN-DIGITALIC_TQFP44 = smd 1.5 x 0.5: 1 -5.8,4; 2 -5.8,3.2; 3 -5.8,2.4; 4 -5.8,1.6; 5 -5.8,0.8; 6 -5.8,0; 7 -5.8,-0.8; 8 -5.8,-1.6; 9 -5.8,-2.4; 10 -5.8,-3.2; 11 -5.8,-4; 23 5.8,-4; 24 5.8,-3.2; 25 5.8,-2.4; 26 5.8,-1.6; 27 5.8,-0.8; 28 5.8,0; 29 5.8,0.8; 30 5.8,1.6; 31 5.8,2.4; 32 5.8,3.2; 33 5.8,4 | smd 0.5 x 1.5: 12 -4,-5.8; 13 -3.2,-5.8; 14 -2.4,-5.8; 15 -1.6,-5.8; 16 -0.8,-5.8; 17 0,-5.8; 18 0.8,-5.8; 19 1.6,-5.8; 20 2.4,-5.8; 21 3.2,-5.8; 22 4,-5.8; 34 4,5.8; 35 3.2,5.8; 36 2.4,5.8; 37 1.6,5.8; 38 0.8,5.8; 39 0,5.8; 40 -0.8,5.8; 41 -1.6,5.8; 42 -2.4,5.8; 43 -3.2,5.8; 44 -4,5.8
SO08-EIAJ = smd 0.61 x 2.21: 1 -1.905,-3.378; 2 -0.635,-3.378; 3 0.635,-3.378; 4 1.905,-3.378; 5 1.905,3.353; 6 0.635,3.353; 7 -0.635,3.353; 8 -1.905,3.353
SOT223 = smd 1.499 x 2.007: 1 -2.261,-3.15; 2 0.025,-3.15; 3 2.311,-3.15 | smd 3.81 x 2.007: 4 0,3.15
POWER_JACK_SMD = smd 2.8 x 2.4: GND 0,-5.7; P$4 6.1,-5.7; VIN0 0,5.7; VIN1 6.1,5.7 | hole 2.032: 0,0; 4.572,0
1X02 = drill 0.914 pad 1.88: 1 0,0; 2 2.54,0
FE05-2 = drill 0.914 square: 1 -5.08,1.27 | drill 0.914: 2 -5.08,-1.27; 3 -2.54,1.27; 4 -2.54,-1.27; 5 0,1.27; 6 0,-1.27; 7 2.54,1.27; 8 2.54,-1.27; 9 5.08,1.27; 10 5.08,-1.27
FIDUCIAL-1X2 = smd 1 x 1: 1 0,0
0603 = smd 1.1 x 1: 1 -0.85,0; 2 0.85,0
LED-1206 = smd 1.2 x 1.4: A -1.5,0; C 1.5,0
SOT23-3 = smd 0.8 x 0.9: 1 -0.95,-1; 2 0.95,-1; 3 0,1.1
ABM2 = smd 2.5 x 3: P$1 -3.25,0; P$2 3.25,0
R0603 = smd 1 x 1.1: 1 -0.85,0; 2 0.85,0
CTS743C163 = smd 0.5 x 0.9: 1 -2.8,-0.8; 2 -2,-0.8; 3 -1.2,-0.8; 4 -0.4,-0.8; 5 0.41,-0.8; 6 1.21,-0.8; 7 2.01,-0.8; 8 2.81,-0.8; 9 2.81,0.8; 10 2.01,0.8; 11 1.21,0.8; 12 0.41,0.8; 13 -0.4,0.8; 14 -1.2,0.8; 15 -2,0.8; 16 -2.8,0.8
TACTILE_SWITCH_SMD = smd 2.3 x 1.1: 1 -2.84,1.905; 2 2.84,1.905; 3 -2.84,-1.905; 4 2.84,-1.905
FE25-2 = drill 0.914 square: 1 -30.48,1.27 | drill 0.914: 2 -30.48,-1.27; 3 -27.94,1.27; 4 -27.94,-1.27; 5 -25.4,1.27; 6 -25.4,-1.27; 7 -22.86,1.27; 8 -22.86,-1.27; 9 -20.32,1.27; 10 -20.32,-1.27; 11 -17.78,1.27; 12 -17.78,-1.27; 13 -15.24,1.27; 14 -15.24,-1.27; 15 -12.7,1.27; 16 -12.7,-1.27; 17 -10.16,1.27; 18 -10.16,-1.27; 19 -7.62,1.27; 20 -7.62,-1.27; 21 -5.08,1.27; 22 -5.08,-1.27; 23 -2.54,1.27; 24 -2.54,-1.27; 25 0,1.27; 26 0,-1.27; 27 2.54,1.27; 28 2.54,-1.27; 29 5.08,1.27; 30 5.08,-1.27; 31 7.62,1.27; 32 7.62,-1.27; 33 10.16,1.27; 34 10.16,-1.27; 35 12.7,1.27; 36 12.7,-1.27; 37 15.24,1.27; 38 15.24,-1.27; 39 17.78,1.27; 40 17.78,-1.27; 41 20.32,1.27; 42 20.32,-1.27; 43 22.86,1.27; 44 22.86,-1.27; 45 25.4,1.27; 46 25.4,-1.27; 47 27.94,1.27; 48 27.94,-1.27; 49 30.48,1.27; 50 30.48,-1.27
PAD.03X.05 = smd 1.27 x 1.27: P$1 0,0
TQ144 = smd 1.6 x 0.296: P1 -11.1,8.75; P2 -11.1,8.25; P3 -11.1,7.75; P4 -11.1,7.25; P5 -11.1,6.75; P6 -11.1,6.25; P7 -11.1,5.75; P8 -11.1,5.25; P9 -11.1,4.75; P10 -11.1,4.25; P11 -11.1,3.75; P12 -11.1,3.25; P13 -11.1,2.75; P14 -11.1,2.25; P15 -11.1,1.75; P16 -11.1,1.25; P17 -11.1,0.75; P18 -11.1,0.25; P19 -11.1,-0.25; P20 -11.1,-0.75; P21 -11.1,-1.25; P22 -11.1,-1.75; P23 -11.1,-2.25; P24 -11.1,-2.75; P25 -11.1,-3.25; P26 -11.1,-3.75; P27 -11.1,-4.25; P28 -11.1,-4.75; P29 -11.1,-5.25; P30 -11.1,-5.75; P31 -11.1,-6.25; P32 -11.1,-6.75; P33 -11.1,-7.25; P34 -11.1,-7.75; P35 -11.1,-8.25; P36 -11.1,-8.75; P73 11.1,-8.75; P74 11.1,-8.25; P75 11.1,-7.75; P76 11.1,-7.25; P77 11.1,-6.75; P78 11.1,-6.25; P79 11.1,-5.75; P80 11.1,-5.25; P81 11.1,-4.75; P82 11.1,-4.25; P83 11.1,-3.75; P84 11.1,-3.25; P85 11.1,-2.75; P86 11.1,-2.25; P87 11.1,-1.75; P88 11.1,-1.25; P89 11.1,-0.75; P90 11.1,-0.25; P91 11.1,0.25; P92 11.1,0.75; P93 11.1,1.25; P94 11.1,1.75; P95 11.1,2.25; P96 11.1,2.75; P97 11.1,3.25; P98 11.1,3.75; P99 11.1,4.25; P100 11.1,4.75; P101 11.1,5.25; P102 11.1,5.75; P103 11.1,6.25; P104 11.1,6.75; P105 11.1,7.25; P106 11.1,7.75; P107 11.1,8.25; P108 11.1,8.75 | smd 0.296 x 1.6: P37 -8.75,-11.1; P38 -8.25,-11.1; P39 -7.75,-11.1; P40 -7.25,-11.1; P41 -6.75,-11.1; P42 -6.25,-11.1; P43 -5.75,-11.1; P44 -5.25,-11.1; P45 -4.75,-11.1; P46 -4.25,-11.1; P47 -3.75,-11.1; P48 -3.25,-11.1; P49 -2.75,-11.1; P50 -2.25,-11.1; P51 -1.75,-11.1; P52 -1.25,-11.1; P53 -0.75,-11.1; P54 -0.25,-11.1; P55 0.25,-11.1; P56 0.75,-11.1; P57 1.25,-11.1; P58 1.75,-11.1; P59 2.25,-11.1; P60 2.75,-11.1; P61 3.25,-11.1; P62 3.75,-11.1; P63 4.25,-11.1; P64 4.75,-11.1; P65 5.25,-11.1; P66 5.75,-11.1; P67 6.25,-11.1; P68 6.75,-11.1; P69 7.25,-11.1; P70 7.75,-11.1; P71 8.25,-11.1; P72 8.75,-11.1; P109 8.75,11.1; P110 8.25,11.1; P111 7.75,11.1; P112 7.25,11.1; P113 6.75,11.1; P114 6.25,11.1; P115 5.75,11.1; P116 5.25,11.1; P117 4.75,11.1; P118 4.25,11.1; P119 3.75,11.1; P120 3.25,11.1; P121 2.75,11.1; P122 2.25,11.1; P123 1.75,11.1; P124 1.25,11.1; P125 0.75,11.1; P126 0.25,11.1; P127 -0.25,11.1; P128 -0.75,11.1; P129 -1.25,11.1; P130 -1.75,11.1; P131 -2.25,11.1; P132 -2.75,11.1; P133 -3.25,11.1; P134 -3.75,11.1; P135 -4.25,11.1; P136 -4.75,11.1; P137 -5.25,11.1; P138 -5.75,11.1; P139 -6.25,11.1; P140 -6.75,11.1; P141 -7.25,11.1; P142 -7.75,11.1; P143 -8.25,11.1; P144 -8.75,11.1
CRYSTAL-OSC-SMD-5X3 = smd 1.2 x 1.1: 1 -1.27,-1.15; 2 1.27,-1.15; 3 1.27,1.15; 4 -1.27,1.15
USB-MICROB = smd 0.35 x 1.4: D+ 0,2.65; D- -0.65,2.65; GND 1.3,2.65; ID 0.65,2.65; VBUS -1.3,2.65 | smd 1.5 x 1.55: P1 -1,0; P2 1,0 | drill 1.15 pad 1.422: P3 -3.5,0; P4 3.5,0 | drill 0.85 pad 1.27: P5 -2.5,2.7; P6 2.5,2.7
CT/CN0603 = smd 1 x 1: 1 -1,0; 2 1,0

### Placement (x,y rotation side)
C1  23,50 0 top
C2  9,39 180 top
C3  18,33 0 top
C4  11.5,48.75 180 top
C5  28.75,39.5 0 top
C6  24.5,15 90 top
C7  18,11 180 top
C8  35.5,15.75 90 top
C9  35.5,19.25 270 top
C10  66,32.88 0 top
C11  45.5,48.25 90 top
C12  35.5,34 180 top
C13  50.38,16.75 270 top
C14  38.75,45.25 90 top
C15  63,45.25 90 top
C16  37.25,18 270 top
C17  63.75,18.5 270 top
C18  39,18 270 top
C19  66,34.25 0 top
C20  67,29 0 top
C21  57.62,16.5 270 top
C22  48.19,16.75 270 top
C23  35,28 180 top
C24  35.5,38.5 180 top
C25  50.75,47.5 90 top
C26  57.75,48.81 90 top
C28  30.25,47.25 270 top
C29  30.25,42.75 90 top
D1  7.25,28.75 90 top
IC1  19,42 90 top
IC2  24.75,27.5 270 top
IC3  19,17 0 top
IC4  30,17.5 0 top
J1  5,15.5 0 top
JP1  3.81,26.67 270 top
JP2  5.08,46.99 270 top
JP3  3.81,54.93 0 top
JP4  74.93,54.93 0 top
JP5  74.93,8.57 0 top
L1  23,51.5 180 top
LED1  11.75,24 180 top
LED2  75,41 0 top
LED3  75,38.5 0 top
LED4  75,36 0 top
LED5  75,33.5 0 top
LED6  75,31 0 top
LED7  75,28.5 0 top
LED8  75,26 0 top
LED9  75,23.5 0 top
Q1  11.75,29 180 top
Q2  33.5,45 90 top
R1  28,37 270 top
R2  18.5,28.25 270 top
R3  11.25,33.25 0 top
R4  11.25,34.75 0 top
R5  15,27.5 180 top
R6  15,30 180 top
R7  70.38,32.25 270 top
R8  38,20.5 0 top
R15  71.25,17.23 90 top
S1  74.98,15.23 270 top
SV1  39.37,5.08 0 top
SV2  39.37,58.42 0 top
TP1  19.05,39.37 0 bottom
TP2  19.05,41.91 0 bottom
TP3  21.59,39.37 0 bottom
TP4  21.59,41.91 0 bottom
TP5  24.13,39.37 0 bottom
TP6  24.13,41.91 0 bottom
U1  51,32 270 top
U2  29,33 0 top
U$1  65.41,13.97 0 top
U$2  39.37,31.75 0 bottom
X1  2,35 270 top
Z1  9,32.25 90 top
Z2  9,35.75 270 top

### Tracks (layer width: path | path; a pad name or v marks a point on that pad's centre or on a via)
+3V3  (via drill 0.38)
  Top 0.203: C20.1 66.12,29.56 65.88,29.81 63.12,29.81 63.06,29.75 U1.P122 60.25,29.75 v60,30 60.75,30.75 60.75,31 61,31.25 U1.P125 | C19.1 64.5,34.25 63.5,33.25 U1.P129 59.69,33.25 59.44,33 58.25,33 58,32.75 v57.25,32.75 | R15.1 v71.25,15 | C17.1 v62.56,19.38 | C15.1 v63,43 | U1.P135 61,36.25 60.5,36.75 59.5,36.75 v59.25,36.5 | C21.1 57.62,18 57.25,18.38 U1.P103 v57.25,23 | U1.P90 50.75,22.75 v51,23 | C22.1 48.25,17.69 48.25,18.56 48.75,19.06 U1.P86 48.75,22.75 v49,23 | U1.P76 43.75,23 v43.5,23.25 | IC1.6 19,35 18.88,34.88 C3.2 18.88,31.88 v18.75,31.75 | R6.1 15.85,29.73 15.81,29.69 v15.81,28.75 15.81,27.54 R5.1 18.4,27.5 R2.2 18.65,27.25 19.25,27.25 19.64,26.86 IC2.3 | IC2.7 IC2.8 28.1,29.9 v27.25,30.75 27.25,31.75 U2.1 U2.4 27.15,34.65 28,35.5 R1.2 | v34,14.75 35.38,14.75 C8.1 | C16.1 C18.1 40.12,18.88 v40.25,19 | C23.1 36.75,28 37,28.25 38,28.25 38.5,27.75 U1.P63 41,27.75 v41.75,28.5 41,29.25 U1.P60 | C5.1 27.77,39.6 IC1.14 24.77,39.62 23.88,39.62 23.25,40.25 v23.25,40.75 | L1.1 v25,51.5 | IC1.34 13.2,46.8 v12.5,47.5 12.5,48.38 C4.1 | U1.P42 39,38.25 38.75,38.5 C24.1 36.38,39.62 v36.25,39.75 | U1.P53 41.5,32.75 41.69,32.56 v42,32.56 | C26.1 57.75,47.25 58.25,46.75 U1.P4 58.25,42 v58,41.75 | C14.1 38.88,44.5 v41.75,44.5 42.25,44 U1.P36 42.25,42 42.5,41.75 44.5,41.75 44.75,42 U1.P31 | U1.P18 51.25,45 v50.75,45.5 | v50.75,45.5 C25.1 | U1.P20 50.25,45 v50.75,45.5
  Top 0.61: IC3.2 19,13.82 19,12.25 18.88,12.12 C7.1 18.94,10.94 v18.94,9.56 | IC4.3 33.6,14.35 v34,14.75
  Bottom 0.203: TP2.P$1 19.16,41.91 20.25,43 22,43 22.75,42.25 22.75,41.25 v23.25,40.75
  other vias: 16,22 16,20.75 16,19.5 16,18.25 17.5,18.25 19,18.25 20.5,18.25 22,18.25 22,19.5 22,20.75 22,22 20.5,22 19,22 17.5,22
  pour Power (isolate 0.406): 1.27,60.96 1.27,2.54 2.54,1.27 76.2,1.27 77.47,2.54 77.47,60.96 76.2,62.23 2.54,62.23
  pour Top (no thermals): 15,23 23,23 23,17.25 15,17.25
+5V
  Top 0.61: C6.1 23.75,13.85 IC3.3 21.31,15.69 21,16 13,16 11,18 5.25,18 5,18.25 | SV1.2 8.44,3.81 4.75,7.5 3.25,7.5 2.25,8.5 2.25,15.5 5,18.25 | D1.1 7.25,26 6.75,25.5 5.18,25.5 JP1.2 3.87,24.13 5,23 J1.VIN0 5,18.25
  Bottom 0.61: SV2.2 4.9,57.15 1.5,53.75 1.5,41.25 2.5,40.25 5.25,40.25 6,39.5 6,26.32 JP1.2
ADC0
  Top 0.203: JP2.9 6.5,41.75 9.75,41.75 11,40.5 13,40.5 IC1.41
ADC1
  Top 0.203: IC1.40 11.05,41.2 9.06,43.19 5.09,43.19 JP2.10
ADC4
  Top 0.203: IC1.39 11,42 9.25,43.75 7,43.75 6.5,44.25 JP2.7
ADC5
  Top 0.203: IC1.38 10.95,42.8 8.06,45.69 5.05,45.69 JP2.8
ADC6
  Top 0.203: JP2.5 6.5,46.75 7,46.25 8.25,46.25 11,43.5 13,43.5 IC1.37
ADC7
  Top 0.203: IC1.36 13,44.5 10.75,44.5 7,48.25 5.75,48.25 4.5,47 4,47 JP2.6
ADC8  (via drill 0.38)
  Top 0.203: v9.5,51.5 9.75,51.25 20,51.25 21.25,50 21.25,49.25 21.5,49 21.5,48 IC1.25
  Bottom 0.203: v9.5,51.5 8.25,51.5 6.5,49.75 JP2.3
ADC9
  Top 0.203: JP2.4 4,49.75 4.75,49.75 5.75,50.75 19.75,50.75 20.5,50 20.5,48 IC1.26
AREF
  Top 0.203: IC1.42 11.6,39.6 11,39 C2.1 10,39.12 10,39.5 9.5,40 3.75,40 2.25,41.5 2.25,50.5 JP2.2
AVCC
  Top 0.203: IC1.44 15.25,38 22.25,45 22.25,47.75 IC1.24 22.2,49.92 C1.1 22.15,50.02 L1.2
AVR_RX  (via drill 0.38)
  Top 0.203: U1.P59 38.75,29.75 38.5,30 32.25,30 v32,30.25 | v27.75,45.25 26.94,44.44 24.84,44.44 IC1.20
  Bottom 0.203: v32,30.25 32,31.25 31.25,32 30.25,32 29,33.25 29,44 v27.75,45.25
AVR_TX  (via drill 0.38)
  Top 0.203: v27.75,46.25 26.75,45.25 25,45.25 IC1.21 | v36.5,32.75 37.5,31.75 U1.P55
  Bottom 0.203: v27.75,46.25 29.5,44.5 29.5,39.75 v36.5,32.75
CCLK
  Top 0.203: U1.P70 35.75,24.25 35.25,24.75 25.75,24.75 23.75,26.75 23.75,37 22.25,38.5 22.25,41.44 23.62,42.81 24.79,42.81 IC1.18
CLK
  Top 0.203: U2.3 32.1,34.15 35,31.25 U1.P56
CS_FLASH  (via drill 0.38)
  Top 0.203: IC2.1 19.41,29.41 19.25,29.25 18.65,29.25 R2.1 18.5,29 v17.25,29 | v23.06,43.62 24.77,43.62 IC1.19
  Bottom 0.203: v17.25,29 16.25,30 16.25,40.5 19.38,43.62 v23.06,43.62
D0
  Top 0.203: U1.P65 30.75,26.75 30,27.5 26.75,27.5 24.75,29.5 24.75,37.95 IC1.12
D1  (via drill 0.38)
  Top 0.203: U1.P62 38.75,28.25 38,29 v30.25,29 | v17.5,45.75 17.5,46.69 17.38,46.81 17.38,47.77 IC1.30
  Bottom 0.203: v30.25,29 29.5,29 28,30.5 28,43 25.25,45.75 v17.5,45.75
D2  (via drill 0.38)
  Top 0.203: U1.P61 39,28.75 38.25,29.5 31.25,29.5 v31,29.75 | v18.56,46.44 18.25,46.75 18.25,47.75 IC1.29
  Bottom 0.203: v31,29.75 29.5,29.75 28.5,30.75 28.5,43.25 25.31,46.44 v18.56,46.44
D3  (via drill 0.38)
  Top 0.203: U1.P46 37.25,36.25 v37,36 | IC1.28 v19,49.25
  Bottom 0.203: v37,36 37,40.75 30.25,47.5 20.75,47.5 v19,49.25
D+
  Top 0.203: IC1.4 17.4,35.4 16.25,34.25 14,34.25 13,33.25 R3.2
D-
  Top 0.203: IC1.3 16.6,35.35 16,34.75 R4.2
DONE  (via drill 0.38)
  Top 0.203: v12.75,28.75 12.75,29.95 | 12.75,29.95 Q1.1 | 12.75,29.95 14.1,29.95 R6.2 14.15,29.35 15,28.5 15,26.75 17.5,24.25 35,24.25 35.5,23.75 U1.P71 | v16.5,45.75 16.5,46.69 16.62,46.81 16.62,47.77 IC1.31
  Bottom 0.203: SV1.6 13.97,4.03 12.75,5.25 v12.75,28.75 15.75,31.75 15.75,40.75 16.5,41.5 v16.5,45.75
GND  (via drill 0.38)
  Top 0.203: S1.1 76.89,21.11 v76.5,21.5 LED9.C LED8.C LED7.C LED6.C LED5.C LED4.C LED3.C LED2.C | C20.2 68.5,29 v69.06,28.44 | C10.2 C19.2 66.88,34.38 v66,35.25 | C17.2 v62.56,17.62 | U1.P113 63.25,25.25 v63.75,24.75 | C15.2 v63,47.5 | U1.P136 61.19,36.75 60.69,37.25 59.5,37.25 v59.25,37.5 | U1.P130 59.25,33.75 59.06,33.56 57.69,33.56 v57.5,33.75 | U1.P108 60.6,20.9 v60.75,20.75 | U1.P91 51.25,16 51,15.75 50.62,15.75 C13.2 50.38,14.88 v50.5,14.75 | U1.P96 v53.75,23 | C21.2 v57.62,14.25 | C22.2 v46.62,15.88 | U1.P77 44.25,22.5 v44.75,23 | Q1.2 10.75,30.05 10.75,30.75 10.25,31.25 Z1.1 9,32 8.75,32.25 8,32.25 6.55,33.7 X1.GND 2.1,33.7 2,33.8 | C2.2 8.25,38.88 v8.25,37.75 9,37 Z2.1 10,36.75 12.05,38.8 IC1.43 | IC1.5 18.25,36.15 18.25,34.75 17.12,33.62 C3.1 17.12,31.88 v17,31.75 | IC2.4 19.47,25.59 v19.44,25.56 | C16.2 36.62,17.12 36.25,16.75 35.62,16.75 C8.2 C9.2 36.38,19.25 36.38,20.25 36.62,20.5 R8.1 | C16.2 C18.2 | v37.25,15.75 C16.2 | U1.P68 U1.P69 38.75,24.75 v38.5,25 | U1.P64 37.75,27.25 v37.5,27.5 | C23.2 v32.75,28 | C12.2 34.62,33.12 v35,32.75 | U2.2 30.85,30.9 v31,30.75 | C28.2 v30.25,45 C29.2 | IC1.23 23,48.75 23.88,49.62 C1.2 v25,50 | C4.2 10.62,46.38 v11.75,45.25 11.8,45.2 IC1.35 13.21,45.19 14.44,45.19 15,45.75 IC1.33 | C24.2 v33.5,38.5 32.5,39.5 C5.2 | U1.P54 41,32.25 v41.25,32 | U1.P49 41,34.75 v41.25,35 41.25,35.5 41,35.75 U1.P47 | U1.P3 58.75,49.31 58.38,49.69 C26.2 v57.75,50.81 | C14.2 37.62,46.12 v37.5,46.25 | C11.2 44.38,49.12 v44.25,49 | C25.2 v50.75,49.5 | U1.P25 47.75,42 v47.5,41.75 | U1.P13 53.75,42 v54,41.75 | IC1.15 26.4,40.4 v26.5,40.5
  Top 0.406: X1.P1 X1.P2 X1.P3 | 2,33.8 X1.P4
  Top 0.61: J1.GND J1.P$4 | J1.P$4 15.05,9.8 16.25,11 C7.2 17,11.12 17,12 16.74,12.26 IC3.1 | C6.2 26.85,16.4 v26.88,16.38 27.75,15.5 27.75,14.36 IC4.1 | SV1.3 11.43,9.47 J1.P$4
  Bottom 0.203: v26.5,40.5 25.54,40.5 TP6.P$1
  pour Ground (isolate 0.406): 2.54,62.23 76.2,62.23 77.47,60.96 77.47,2.54 76.2,1.27 2.54,1.27 1.27,2.54 1.27,60.96
INIT_B  (via drill 0.38)
  Top 0.203: v37.75,39.75 U1.P39 | v28.75,48.25 26.5,46 IC1.22
  Bottom 0.203: v37.75,39.75 37.5,40 37.5,41 30.5,48 29,48 v28.75,48.25
L1N_0
  Top 0.203: U1.P143 63,40.25 63.5,40.75 63.5,41.5 62,43 62,50.5 59.5,53 56.22,53 SV2.36
L1N_1
  Top 0.203: U1.P104 57.75,18.75 58.5,18 58.5,12 56.75,10.25 55.25,10.25 53.75,8.75 50.25,8.75 48.25,6.75 48.25,5.09 SV1.34
L1N_3
  Top 0.203: U1.P34 43.25,45 37.75,50.5 28,50.5 25.5,53 23.2,53 SV2.10
L1P_0
  Top 0.203: U1.P144 62.75,40.75 63,41 63,41.25 61.5,42.75 61.5,50.25 59.25,52.5 55,52.5 51,56.5 51,58.25 52.25,59.5 SV2.35
L1P_1
  Top 0.203: U1.P105 58.25,19 59,18.25 59,11.75 57,9.75 55.5,9.75 54,8.25 51.43,8.25 SV1.33
L1P_3
  Top 0.203: U1.P35 42.75,44.75 37.5,50 27.75,50 25.25,52.5 21.25,52.5 17.75,56 17.75,58.39 SV2.9
L2N_0
  Top 0.203: U1.P141 63.25,39.25 64.5,40.5 64.5,49.5 60,54 57.76,54 SV2.38
L2N_2  (via drill 0.38)
  Top 0.203: U1.P66 41.5,26.25 v41.75,26.5
  Bottom 0.203: v41.75,26.5 41.75,26 41,25.25 41,24 25.5,8.5 19.5,8.5 17.75,6.75 17.75,5.11 SV1.10
L2N_3
  Top 0.203: U1.P32 44.25,45.5 38.25,51.5 28.5,51.5 26,54 24.74,54 SV2.12
L2P_0
  Top 0.203: U1.P142 63.12,39.75 64,40.62 64,49.25 59.75,53.5 56.5,53.5 53.5,56.5 53.5,58.58 SV2.37
L2P_2  (via drill 0.38)
  Top 0.203: U1.P67 41,25.75 v41.75,25
  Bottom 0.203: v41.75,25 41.75,24 25.75,8 20.7,8 SV1.9
L2P_3
  Top 0.203: U1.P33 43.75,45.25 38,51 28.25,51 25.75,53.5 23.5,53.5 20.5,56.5 20.5,58.6 SV2.11
L3N_0
  Top 0.203: U1.P139 63.56,38.25 65.5,40.19 65.5,50 60.5,55 59.3,55 SV2.40
L3P_0
  Top 0.203: U1.P140 63.38,38.75 65,40.38 65,49.75 60.25,54.5 58,54.5 56,56.5 56,58.54 SV2.39
L4N_0
  Top 0.203: U1.P137 63.94,37.25 66.5,39.81 66.5,50.34 SV2.42
L4P_0
  Top 0.203: U1.P138 63.75,37.75 66,40 66,50.25 60.75,55.5 59.5,55.5 58.5,56.5 58.5,58.5 SV2.41
L14N_2  (via drill 0.38)
  Top 0.203: v41.25,31 41,30.75 U1.P57
  Bottom 0.203: v41.25,31 40.5,30.25 40.5,30 40,29.5 40,24.5 26.25,10.75 18.25,10.75 16.75,9.25 16.75,8.25 15.25,6.75 15.25,6 15.75,5.5 15.75,4.75 16.5,4 SV1.8
L14P_2  (via drill 0.38)
  Top 0.203: v41.25,30 41,30.25 U1.P58
  Bottom 0.203: v41.25,30 40.5,29.25 40.5,24.25 26.5,10.25 18.5,10.25 17.25,9 17.25,7 16.75,6.5 SV1.7
L31N_2  (via drill 0.38)
  Top 0.203: U1.P50 41.5,34.25 42.5,35.25 v42.5,37.75
  Bottom 0.203: v42.5,37.75 41,37.75 39.25,39.5 39.25,47.25 32,54.5 16.62,54.5 SV2.6
L31P_2  (via drill 0.38)
  Top 0.203: U1.P51 41.75,33.75 43,35 43,36.75 v43.25,37
  Bottom 0.203: v43.25,37 41,37 38.75,39.25 38.75,47 31.75,54 15.25,54 12.75,56.5 12.75,58.47 SV2.5
L32N_1
  Top 0.203: U1.P101 56.25,12.75 53.25,9.75 48.5,9.75 45.75,7 45.75,5.05 SV1.32
L32P_1
  Top 0.203: U1.P102 56.75,12.5 53.5,9.25 49.89,9.25 SV1.31
L33N_1
  Top 0.203: U1.P99 55.25,13.25 52.75,10.75 47,10.75 43.25,7 43.25,5.01 SV1.30
L33P_1
  Top 0.203: U1.P100 55.75,13 53,10.25 48.35,10.25 SV1.29
L34N_0  (via drill 0.38)
  Top 0.203: R7.2 69,34.25 68.75,34.5 68.75,35.38 67.12,37 64.94,37 63.19,35.25 U1.P133 60,35.25 59.75,35.5 v59.25,35.5
  Bottom 0.203: SV2.44 62.23,35.98 61.5,35.25 60,35.25 59.75,35.5 v59.25,35.5
L34N_1
  Top 0.203: U1.P97 54.25,13.75 52.25,11.75 45.5,11.75 40.75,7 40.75,4.97 SV1.28
L34P_0  (via drill 0.38)
  Top 0.203: R7.1 69.58,35.42 67.56,37.44 64.75,37.44 63.06,35.75 U1.P134 60.75,35.75 60.5,36 v60.25,36
  Bottom 0.203: SV2.43 62.23,58.98 61,57.75 61,56.25 61.75,55.5 61.75,36.25 61.5,36 v60.25,36
L34P_1
  Top 0.203: U1.P98 54.75,13.5 52.5,11.25 46.81,11.25 SV1.27
L35N_0  (via drill 0.38)
  Top 0.203: R7.4 68.1,32.65 67.75,33 67.75,35 66.75,36 65.25,36 63.5,34.25 U1.P131 v58.5,34.25
  Bottom 0.203: SV2.46 64.77,57.02 64.75,57 64.75,36 63,34.25 v58.5,34.25
L35P_0  (via drill 0.38)
  Top 0.203: R7.3 68.55,33.45 68.25,33.75 68.25,35.25 67,36.5 65.06,36.5 63.31,34.75 U1.P132 59,34.75 58.75,35 v58,35
  Bottom 0.203: SV2.45 64.77,59.02 63.5,57.75 63.5,56.25 64.25,55.5 64.25,36.25 62.75,34.75 59,34.75 58.75,35 v58,35
L36N_0  (via drill 0.38)
  Top 0.203: R7.6 68.96,31.04 68.75,31.25 64.25,31.25 63.75,31.75 U1.P126 60.5,31.75 v60,31.25
  Bottom 0.203: SV2.48 67.31,57.06 67.25,57 67.25,33.25 65.75,31.75 60.5,31.75 v60,31.25
L36N_3
  Top 0.203: U1.P29 45.75,45.5 38.75,52.5 29,52.5 26.25,55.25 26.03,55.25 SV2.14
L36P_0  (via drill 0.38)
  Top 0.203: R7.5 64.41,31.84 64,32.25 U1.P127 60,32.25 v59,31.25
  Bottom 0.203: SV2.47 67.19,59.69 66,58.5 66,56.25 66.75,55.5 66.75,33.5 65.5,32.25 60,32.25 v59,31.25
L36P_3
  Top 0.203: U1.P30 45.25,45.25 38.5,52 28.75,52 26.25,54.5 25,54.5 23,56.5 23,58.56 SV2.13
L37N_0  (via drill 0.38)
  Top 0.203: U1.P123 68.25,30.25 69.06,29.44 R7.8 69.5,29.25 70,28.75 70,27.5 v69.75,27.25
  Bottom 0.203: SV2.50 69.85,55.85 69.75,55.75 v69.75,27.25
L37N_3
  Top 0.203: U1.P26 47.25,49.75 46.5,50.5 42.25,50.5 39.25,53.5 30.32,53.5 SV2.16
L37P_0  (via drill 0.38)
  Top 0.203: U1.P124 68.5,30.75 69.01,30.24 R7.7 70.25,30.25 70.38,30.12 70.38,29 70.5,28.88 v70.5,26.75
  Bottom 0.203: SV2.49 69.85,59.65 71,58.5 71,56.25 70.25,55.5 70.25,27.75 70.5,27.5 v70.5,26.75
L37P_3
  Top 0.203: U1.P27 46.75,49.5 46.25,50 42,50 39,53 29.25,53 25.5,56.75 25.5,58.52 SV2.15
L40N_1
  Top 0.203: U1.P94 52.75,13.75 51.75,12.75 45.12,12.75 43.12,10.75 40.12,7.75 39,7.75 38.25,7 38.25,4.93 SV1.26
L40P_1
  Top 0.203: U1.P95 53.25,13.5 52,12.25 45.27,12.25 SV1.25
L41N_1
  Top 0.203: U1.P92 51.75,14.25 51.25,13.75 44.75,13.75 42.75,11.75 39.75,8.75 38.5,8.75 37.5,7.75 36.5,7.75 35.75,7 35.75,4.89 SV1.24
L41N_3
  Top 0.203: U1.P23 48.75,49.75 47,51.5 42.75,51.5 39.75,54.5 31.86,54.5 SV2.18
L41P_1
  Top 0.203: U1.P93 52.25,14 51.5,13.25 44.94,13.25 39.94,8.25 38.73,8.25 SV1.23
L41P_3
  Top 0.203: U1.P24 48.25,49.5 46.75,51 42.5,51 39.5,54 30.5,54 28,56.5 28,58.48 SV2.17
L42N_1
  Top 0.203: U1.P87 49.25,18.62 49.06,18.44 49.06,15.06 48.75,14.75 44.25,14.75 39.25,9.75 38,9.75 37,8.75 35,8.75 33.19,6.94 33.19,4.97 SV1.22
L42N_3
  Top 0.203: U1.P21 49.75,50.25 47.5,52.5 43.25,52.5 40.25,55.5 33.4,55.5 SV2.20
L42P_1
  Top 0.203: U1.P88 49.75,18.5 49.5,18.25 49.5,14.75 49,14.25 44.5,14.25 42.75,12.5 39.5,9.25 38.25,9.25 37.25,8.25 36.19,8.25 SV1.21
L42P_3
  Top 0.203: U1.P22 49.25,50 47.25,52 43,52 40,55 32.25,55 30.5,56.75 30.5,58.44 SV2.19
L43N_1  (via drill 0.38)
  Top 0.203: U1.P84 47.75,23.75 v47.5,24
  Bottom 0.203: v47.5,24 47.5,22.75 32.25,7.5 31,7.5 30.5,7 30.5,5.06 SV1.20
L43N_3  (via drill 0.38)
  Top 0.203: U1.P16 52.25,42 v52.5,41.75
  Bottom 0.203: SV2.22 48.94,42.5 52.5,42.5 v52.5,41.75
L43P_1  (via drill 0.38)
  Top 0.203: U1.P85 48.25,23.75 v48.5,24
  Bottom 0.203: v48.5,24 48.25,23.75 48.25,22.85 SV1.19
L43P_3  (via drill 0.38)
  Top 0.203: U1.P17 v51.75,41.25
  Bottom 0.203: v51.75,41.25 49.5,41.25 35.25,55.5 34.25,55.5 33,56.75 33,58.4 SV2.21
L44N_3  (via drill 0.38)
  Top 0.203: U1.P14 53.25,46.25 v52.5,47
  Bottom 0.203: v52.5,47 51.75,47 44.5,54.25 39.73,54.25 SV2.24
L44P_3  (via drill 0.38)
  Top 0.203: U1.P15 52.75,45.25 v52,46
  Bottom 0.203: v52,46 44.25,53.75 38.5,53.75 35.5,56.75 35.5,58.36 SV2.23
L45N_1
  Top 0.203: U1.P82 46.75,18.75 38.75,10.75 37.5,10.75 36.5,9.75 30.75,9.75 28,7 28,5.02 SV1.18
L45P_1
  Top 0.203: U1.P83 47.25,18.5 39,10.25 37.75,10.25 36.75,9.25 32.11,9.25 SV1.17
L46N_1
  Top 0.203: U1.P80 45.75,19.25 38.25,11.75 37,11.75 36,10.75 29.25,10.75 25.5,7 25.5,4.98 SV1.16
L46P_1
  Top 0.203: U1.P81 46.25,19 38.5,11.25 37.25,11.25 36.25,10.25 30.57,10.25 SV1.15
L47N_1
  Top 0.203: U1.P78 44.75,19.75 37.75,12.75 36.5,12.75 35.5,11.75 27.75,11.75 23,7 23,4.94 SV1.14
L47P_1
  Top 0.203: U1.P79 45.25,19.5 38,12.25 36.75,12.25 35.75,11.25 29.03,11.25 SV1.13
L49N_3  (via drill 0.38)
  Top 0.203: U1.P11 54.75,44.75 v54,45.5
  Bottom 0.203: v54,45.5 54,48 46.75,55.25 41.27,55.25 SV2.26
L49P_3  (via drill 0.38)
  Top 0.203: U1.P12 54.25,44.25 v54,44.5
  Bottom 0.203: v54,44.5 53.25,45.25 53.25,48 46.5,54.75 40,54.75 38.25,56.5 38.25,58.57 SV2.25
L50N_3
  Top 0.203: U1.P9 55.75,45.5 52.25,49 52.25,50 48.75,53.5 45.56,53.5 SV2.28
L50P_3
  Top 0.203: U1.P10 55.25,45.25 51.75,48.75 51.75,49.75 48.5,53 44.25,53 40.75,56.5 40.75,58.53 SV2.27
L51N_3
  Top 0.203: U1.P7 56.75,46 53.25,49.5 53.25,50.5 49.31,54.44 47.16,54.44 SV2.30
L51P_3
  Top 0.203: U1.P8 56.25,45.75 52.75,49.25 52.75,50.25 49,54 46,54 43.25,56.75 43.25,58.49 SV2.29
L52N_3
  Top 0.203: U1.P5 57.75,46.38 54.25,49.88 54.25,51 49.94,55.31 48.83,55.31 SV2.32
L52P_3
  Top 0.203: U1.P6 57.25,46.19 53.75,49.69 53.75,50.75 49.62,54.88 47.62,54.88 45.75,56.75 45.75,58.45 SV2.31
L62N_0  (via drill 0.38)
  Top 0.203: U1.P120 63.5,28.75 63.56,28.69 v64.12,28.69
  Bottom 0.203: v64.12,28.69 65.75,26.94 65.75,11.75 61,7 61,5.04 SV1.44
L62P_0  (via drill 0.38)
  Top 0.203: U1.P121 63.19,29.25 63.31,29.38 64.62,29.38 v65,29
  Bottom 0.203: v65,29 65,28.75 66.25,27.5 66.25,10.37 SV1.43
L63N_0
  Top 0.203: U1.P118 63.38,27.75 63.56,27.56 65.44,27.56 66.75,26.25 66.75,15.25 58.5,7 58.5,5 SV1.42
L63P_0
  Top 0.203: U1.P119 63.5,28.25 63.75,28 65.75,28 67.25,26.5 67.25,13.91 SV1.41
L64N_0
  Top 0.203: U1.P116 63.12,26.75 63.19,26.69 64.81,26.69 65.75,25.75 65.75,16.25 57.25,7.75 56.75,7.75 56,7 56,4.96 SV1.40
L64N_2  (via drill 0.38)
  Top 0.203: U1.P40 42,39.25 v42.25,39.5
  Bottom 0.203: v42.25,39.5 40.75,39.5 40.25,40 40.25,47.75 32.5,55.5 18.16,55.5 SV2.8
L64P_0
  Top 0.203: U1.P117 63.19,27.25 63.31,27.12 65.12,27.12 66.25,26 66.25,15.45 SV1.39
L64P_2  (via drill 0.38)
  Top 0.203: U1.P41 41.25,38.75 v41.5,38.5
  Bottom 0.203: v41.5,38.5 41,38.5 39.75,39.75 39.75,47.5 32.25,55 16.75,55 15.25,56.5 15.25,58.43 SV2.7
L65N_0
  Top 0.203: U1.P114 64.25,25.75 64.75,25.25 64.75,16.75 57.25,9.25 55.75,9.25 53.5,7 53.5,4.92 SV1.38
L65N_2  (via drill 0.38)
  Top 0.203: S1.3 72.77,18.08 R15.2 71.25,18 v69.75,18 69.75,6.45 SV1.49 | v41.25,40.25 U1.P38
  Bottom 0.203: v41.25,40.25 48.75,40.25 59.75,29.25 60.75,29.25 62.25,30.75 66,30.75 68.25,28.5 68.25,19.5 v69.75,18
L65P_0
  Top 0.203: U1.P115 64.5,26.25 65.25,25.5 65.25,16.49 57.25,8.5 56.75,8.5 54.75,6.5 SV1.37
L66N_0  (via drill 0.38)
  Top 0.203: U1.P111 60.25,24.25 59.75,24.75 v59.75,25
  Bottom 0.203: v59.75,25 59.75,26 60.25,26.5 64,26.5 65.25,25.25 65.25,18 62.75,15.5 61,15.5 53.5,8 53.5,5.24 SV1.36
L66P_0  (via drill 0.38)
  Top 0.203: U1.P112 60.75,24.75 60.5,25 v60.5,25.75
  Bottom 0.203: v60.5,25.75 64,25.75 64.75,25 64.75,18.25 62.5,16 60.75,16 52.25,7.5 52.25,6.53 SV1.35
L74N_1
  Top 0.203: U1.P74 42.75,19.25 37.25,13.75 36,13.75 35,12.75 26.25,12.75 20.5,7 20.5,4.9 SV1.12
L74P_1
  Top 0.203: U1.P75 43.25,19 37.5,13.25 36.25,13.25 35.25,12.25 27.5,12.25 26,10.75 25.99,10.75 SV1.11
L83N_3
  Top 0.203: U1.P1 59.75,51.25 59,52 54.68,52 SV2.34
L83P_3
  Top 0.203: U1.P2 59.25,51 58.75,51.5 54.5,51.5 50.25,55.75 49,55.75 48.25,56.5 48.25,58.41 SV2.33
MISO  (via drill 0.38)
  Top 0.203: IC2.2 22.64,28.14 23,28.5 v23,33 IC1.11 23,37 22,38 v19.25,38 | U1.P45 36.25,36.75 36,36.5 29.25,36.5 28.75,37 v27,37
  Bottom 0.203: v23,33 v27,37 | TP1.P$1 19.05,38.2 v19.25,38
MOSI  (via drill 0.38)
  Top 0.203: IC1.10 22.2,34.05 v22.25,34 | v26.19,25.62 28.07,25.62 IC2.5 28.25,25.5 29.5,25.5 29.75,25.25 33.75,25.25 v34.5,26 | v41.5,36.25 41.5,36.75 41,37.25 U1.P44
  Bottom 0.203: v26.19,25.62 27,26.44 27,27.25 22.25,32 v22.25,34 22.5,34.25 22.5,38.75 22.75,39 22.75,39.75 21.59,40.91 TP4.P$1 | v41.5,36.25 39,33.75 39,32.75 34,27.75 34,26.5 v34.5,26
N$1
  Top 0.203: R5.2 14.15,26.15 13.25,25.25 LED1.A
N$2
  Top 0.203: Q1.3 11.75,26.75 10.25,25.25 LED1.C
N$3
  Top 0.203: R7.16 71.17,38.67 LED2.A
N$4
  Top 0.203: R7.15 71.75,34.25 72,34.5 72,37 LED3.A
N$5
  Top 0.203: R7.14 72.2,33.45 72.5,33.75 72.5,35 LED4.A
N$6
  Top 0.203: R7.13 72.65,32.65 LED5.A
N$7
  Top 0.203: R7.12 72.66,31.84 LED6.A
N$8
  Top 0.203: R7.11 72.21,31.04 72.5,30.75 72.5,29.5 LED7.A
N$9
  Top 0.203: R7.10 71.76,30.24 72,30 72,27.5 LED8.A
N$10
  Top 0.203: R7.9 71.17,25.82 LED9.A
N$11
  Top 0.203: X1.D+ 6.25,35 8,33.25 Z1.2 R3.1
N$12
  Top 0.203: X1.D- 6.6,35.65 7.5,34.75 Z2.2 R4.1
N$13
  Top 0.203: Q2.P$2 30.38,48.25 C28.1 30.12,48 29.5,48 29,47.5 29,42.75 28.25,42 IC1.17
N$14
  Top 0.203: Q2.P$1 30.38,41.75 C29.1 30.12,41.75 29.5,41.75 28.95,41.2 IC1.16
PROGRAM_B  (via drill 0.38)
  Top 0.203: v36,40.75 U1.P37 | v15.75,46.5 15.75,47.75 IC1.32
  Bottom 0.203: v36,40.75 35.5,40.75 29.25,47 19,47 18.75,47.25 16.5,47.25 v15.75,46.5
RESET_AVR  (via drill 0.38)
  Top 0.203: R1.1 27.85,38 v26.75,38 25.95,38.8 IC1.13 23.55,38.8 v23.25,38.5
  Bottom 0.203: v23.25,38.5 v23.26,38.5 TP5.P$1
SCK  (via drill 0.38)
  Top 0.203: IC1.9 21.4,34.6 v21.5,34.5 | v26.12,26.88 28.09,26.88 IC2.6 28.25,26.75 30,26.75 30.5,26.25 33.25,26.25 v33.5,26 | v38.25,37.75 U1.P43
  Bottom 0.203: v26.12,26.88 21.5,31.5 v21.5,34.5 21.59,34.59 TP3.P$1 | v38.25,37.75 38.25,35.75 38.5,35.5 38.5,33 33.5,28 v33.5,26
SS  (via drill 0.38)
  Top 0.203: IC1.8 20.6,35.02 20.5,35 20.25,34.75 v20.25,30.5 | v37.75,35.25 U1.P48
  Bottom 0.203: v37.75,35.25 37.75,33 33.5,28.75 31,28.75 27,24.75 26,24.75 v20.25,30.5
SUSPEND  (via drill 0.38)
  Top 0.203: U1.P73 42.25,20 v41.5,19.25 40.25,20.5 R8.2
  Bottom 0.203: v41.5,19.25 41.5,17.5 32,8 29,8 28,7 28,3 27.5,2.5 16,2.5 15.25,3.25 15.25,5.07 SV1.5
TCK  (via drill 0.38)
  Top 0.203: U1.P109 59,23.25 v58,24.25
  Bottom 0.203: v58,24.25 58,25.75 62.5,30.25 65.75,30.25 67.75,28.25 67.75,8 68.5,7.25 68.5,5 SV1.48
TDI  (via drill 0.38)
  Top 0.203: U1.P110 59.5,23.75 v59,24.25
  Bottom 0.203: v59,24.25 59,26 62.75,29.75 65.5,29.75 67.25,28 67.25,6.41 SV1.47
TDO  (via drill 0.38)
  Top 0.203: U1.P106 58.75,19.5 59.75,18.5 v59.75,13
  Bottom 0.203: v59.75,13 59.75,10.75 56,7 56,3 57,2 64,2 64.75,2.75 64.75,3.79 SV1.46
TMS  (via drill 0.38)
  Top 0.203: U1.P107 59.25,19.75 60.5,18.5 v60.5,13.75
  Bottom 0.203: v60.5,13.75 60.5,9 58.5,7 58.5,3.25 59.25,2.5 63,2.5 63.5,3 63.5,5.08 SV1.45
VBUS  (via drill 0.38)
  Top 0.203: IC1.7 19.8,31.55 19.25,31 12.25,31 11.75,30.5 11.75,29.5 11.25,29 9.5,29 8.05,30.45 D1.2
  Top 0.406: X1.VBUS 7.2,36.3 v7.25,36.25
  Top 0.61: v7.25,32 D1.2
  Bottom 0.61: v7.25,36.25 v7.25,32
VCCINT
  Top 0.203: C10.1 65,32.75 U1.P128 59.88,32.75 59.38,32.25 58.5,32.25 58.25,32 51,32 | 51,32 51,35.5 50.75,35.75 U1.P19 | 49.75,33.25 46.25,36.75 U1.P28 46.25,45.75 45.5,46.5 C11.1 | 49.75,33.25 51,32 | 49.75,33.25 U1.P52 37.75,33.25 37,34 C12.1 | 50.25,31.25 U1.P89 50.25,17.75 C13.1 | 50.25,31.25 51,32 | 42,23 50.25,31.25
  Top 0.61: 42,23 40.62,21.62 36.12,21.62 35.5,21 C9.1 30.52,20.12 IC4.4 30.02,20.62 IC4.2
  pour Top (isolate 0.254): 41.5,41.25 41.75,41.5 60,41.5 60.5,41 60.5,23 60,22.5 41.75,22.5 41.5,22.75 41.5,41
  pour Top (no thermals): 25.75,23.5 34.25,23.5 34.25,17.75 25.75,17.75

### Text on the board
tFinish: GND | GND | 51 | 41 | 35 | 33 | 30 | 27 | 24 | 22 | 17 | 15 | 12 | 10 | 8 | 6 | 2 | 144 | 142 | 140 | 138 | 134 | 132 | 127 | 124 | RAW | +V | 50 | 40 | 34 | 32 | 29 | 26 | 23 | 21 | 16 | 14 | 11 | 9 | 7 | 5 | 1 | 143 | 141 | 139 | 137 | 133 | 131 | 126 | 123 | AREF | GND | A9 | A8 | A7 | A6 | A5 | A4 | A1 | A0 | 4.8V-12V | - | DONE | + | Reset | GND | SUS | 58 | 67 | 75 | 79 | 81 | 83 | 85 | 88 | 93 | 95 | 98 | 100 | 102 | 105 | 112 | 115 | 117 | 119 | 121 | TMS | TDI | RST | RAW | +V | DONE | 57 | 66 | 74 | 78 | 80 | 82 | 84 | 87 | 92 | 94 | 97 | 99 | 101 | 104 | 111 | 114 | 116 | 118 | 120 | TDO | TCK | GND